# Altium project SmartHome V3.PrjPCB
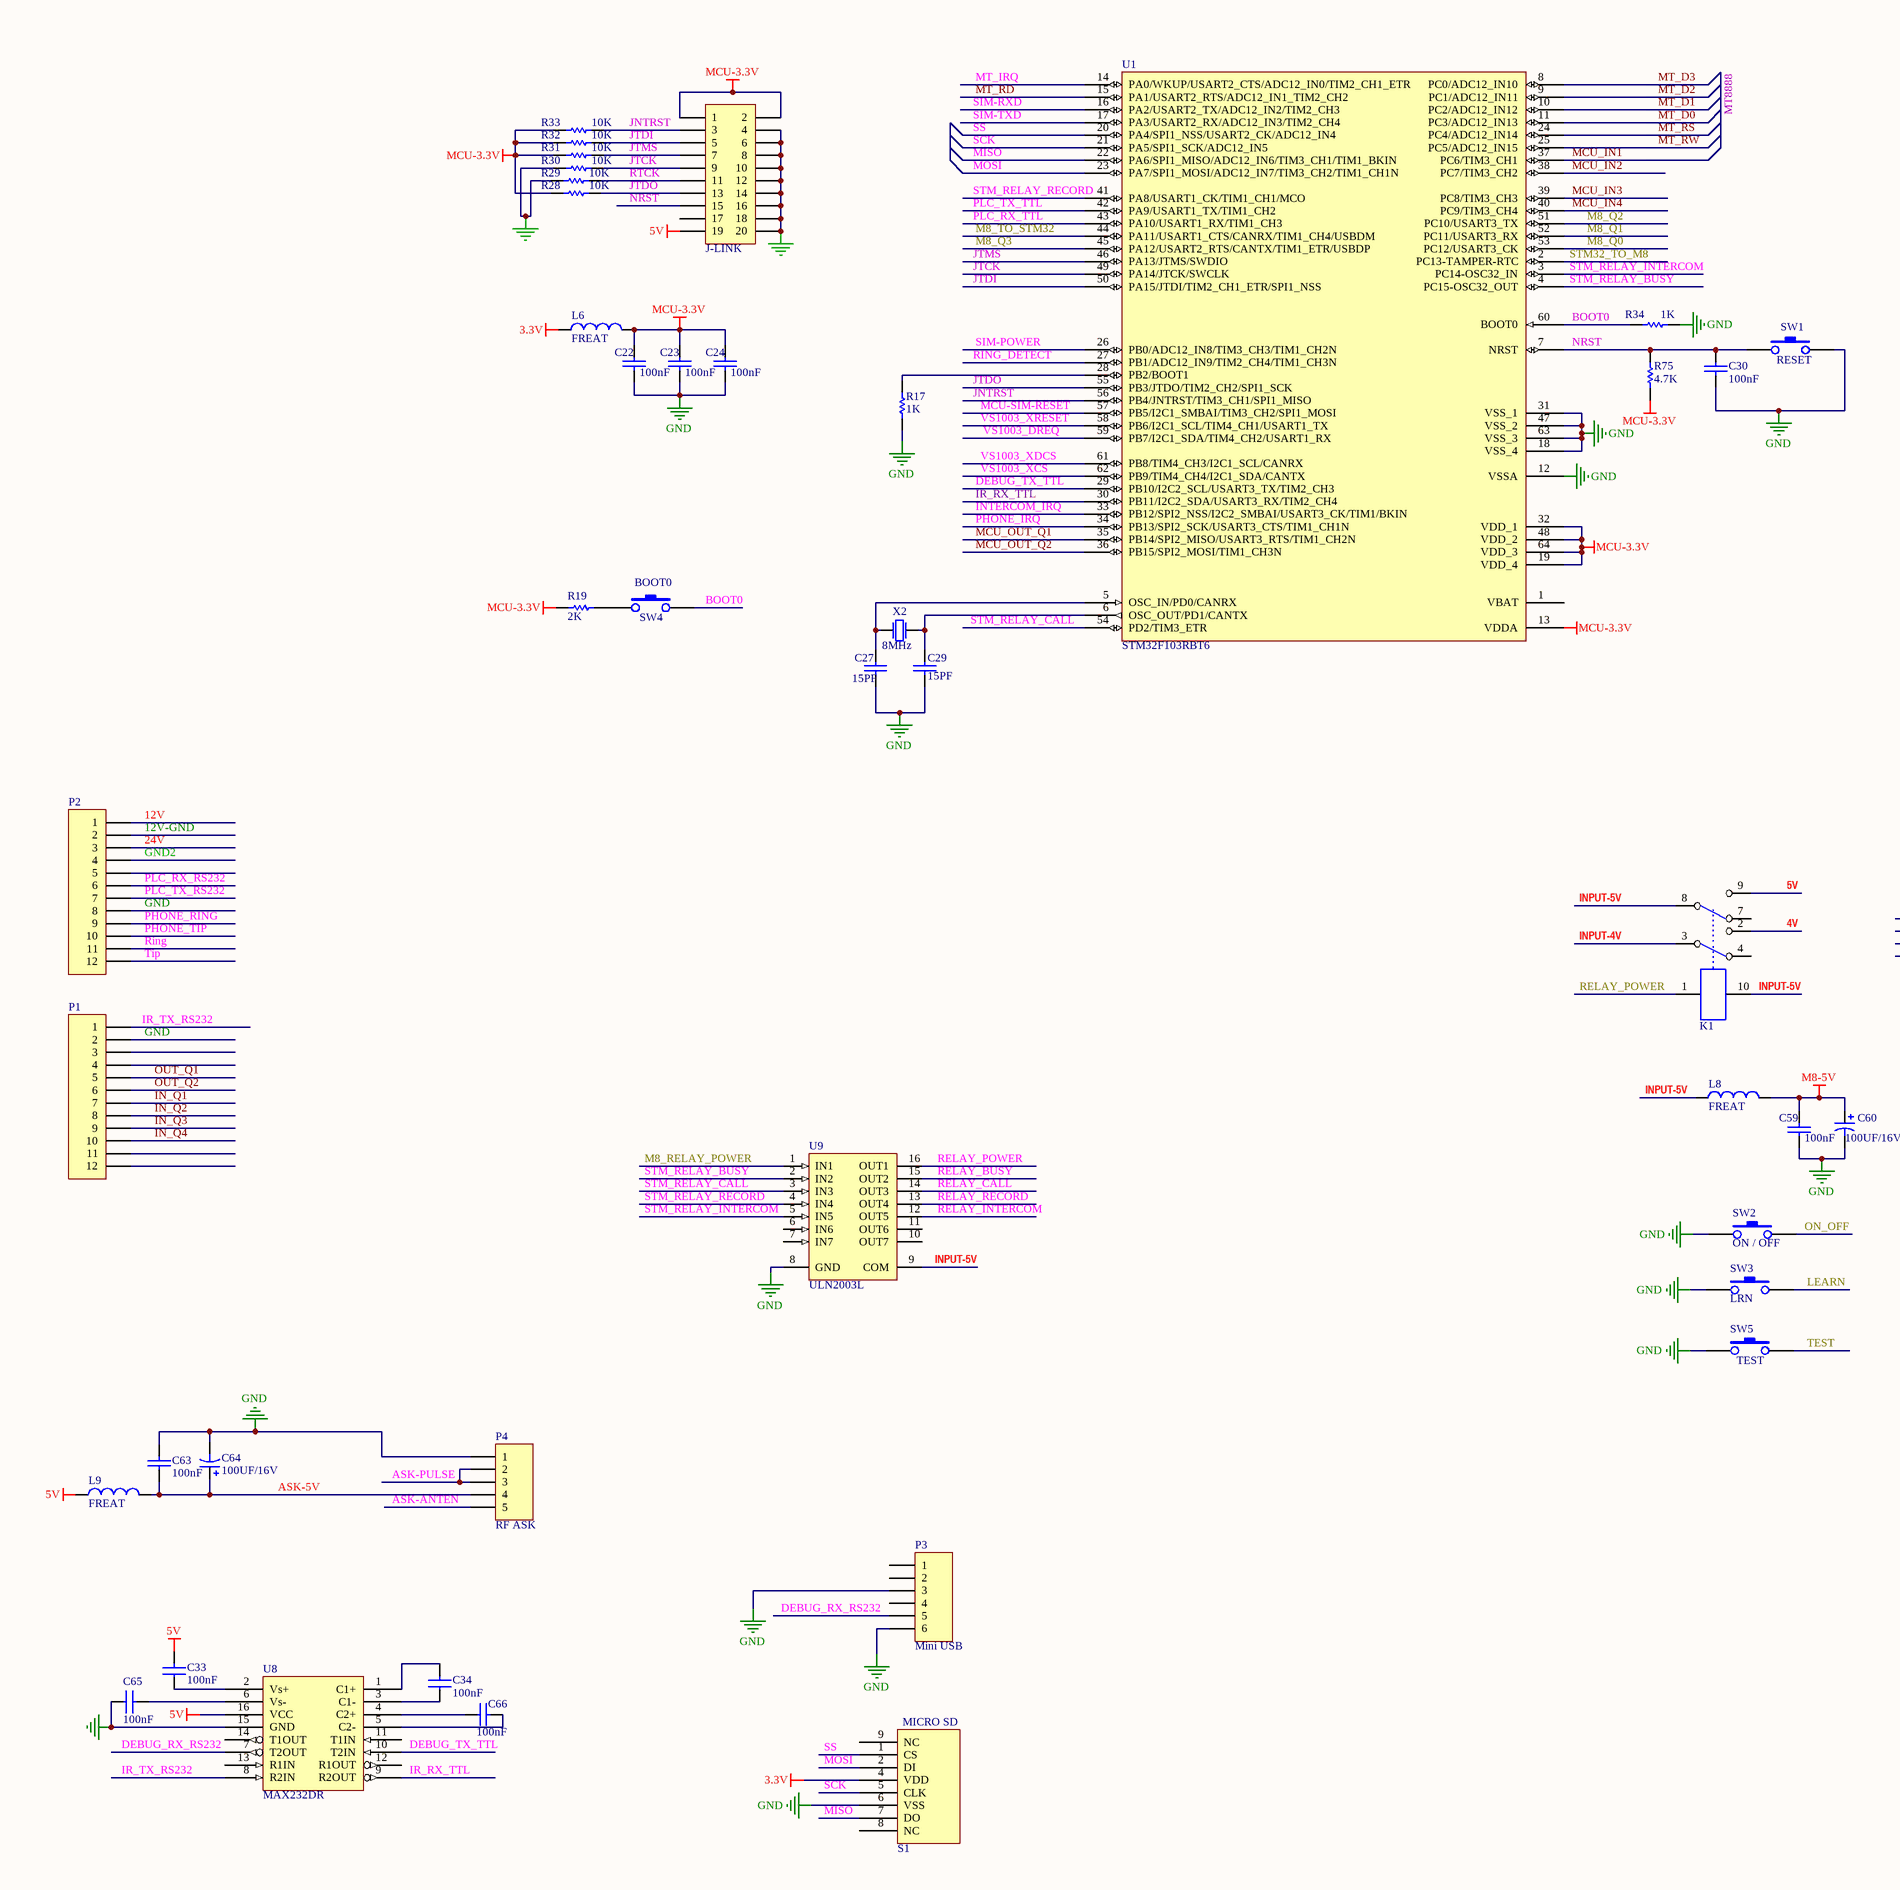
[diagram p0: SmartHome V3.SchDoc, left]
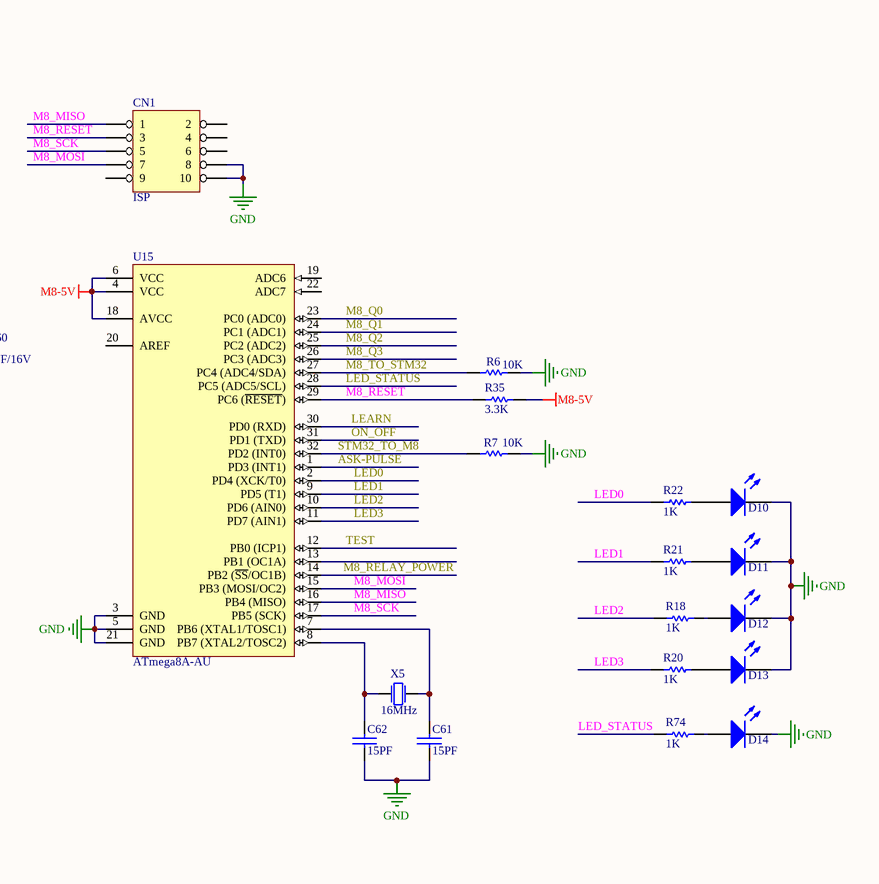
[diagram p1: SmartHome V3.SchDoc, right]
6 sheets, 247 parts. Net scope: global (net labels, ports and power ports of the same name join across sheets).
Board file: SmartHome V3.PcbDoc
Sheets:
  SmartHome V3.SchDoc
  SIM900.SchDoc
  VS1003.SchDoc
  POWER.SchDoc
  PHONE.SchDoc
  PLC.SchDoc

## Sheet SmartHome V3.SchDoc
size A2

### Parts
C22  100nF  [0805C]
C23  100nF  [0805C]
C24  100nF  [0805C]
C27  15PF  [0805c]
C29  15PF  [0805c]
C30  100nF  [0805C]
C33  100nF  [0805C]
C34  100nF  [0805c]
C59  100nF  [0805C]
C60  value 100UF/16V  [100UF-SMD]  (hidden comment: 100uF / 16V SMD)
C61  15PF  [0805c]
C62  15PF  [0805c]
C63  100nF  [0805C]
C64  value 100UF/16V  [100UF-SMD]  (hidden comment: 100uF / 16V SMD)
C65  100nF  [0805c]
C66  100nF  [0805c]
CN1  ISP  [IDC2.54-V10D]
D10  LED  [0805D]  (value not drawn)
D11  LED  [0805D]  (value not drawn)
D12  LED  [0805D]  (value not drawn)
D13  LED  [0805D]  (value not drawn)
D14  LED  [0805D]  (value not drawn)
J-LINK  IDC 20  [IDC2.54-V20D]  (value not drawn)
K1  RELAY 5V  [RELAY G6H]  (value not drawn)
L6  FREAT  [1206]
L8  FREAT  [1206]
L9  FREAT  [1206]
P1  FONIX-12  [Fonit_Conector]  (value not drawn)
P2  FONIX-12  [Fonit_Conector]  (value not drawn)
P3  Mini USB  [miniusb]
P4  RF ASK  [ASK-RF]
R6  10K  [0805]
R7  10K  [0805]
R17  value 1K  [0805]  (hidden comment: 10K)
R18  1K  [0805]
R19  value 2K  [0805]  (hidden comment: 10K)
R20  1K  [0805]
R21  1K  [0805]
R22  1K  [0805]
R28  10K  [0805]
R29  10K  [0805]
R30  10K  [0805]
R31  10K  [0805]
R32  10K  [0805]
R33  10K  [0805]
R34  1K  [0805]
R35  3.3K  [0805]
R74  1K  [0805]
R75  4.7K  [0805]
S1  MICRO SD  [MicroSD]
SW1  SWITCH  [SWICH]  (value not drawn)
SW2  SWITCH  [SWICH]  (value not drawn)
SW3  SWITCH  [SWICH]  (value not drawn)
SW4  SWITCH  [SWICH]  (value not drawn)
SW5  SWITCH  [SWICH]  (value not drawn)
U1  STM32F103RBT6  [LQFP64_L]
U8  MAX232DR  [L16_N]
U9  ULN2003L  [L16_N]
U15  ATmega8A-AU  [32A_N]
X2  8MHz  [crystal]
X5  16MHz  [crystal]

### Nets
3.3V: L6.2 S1.4(VDD)
4V: K1.2(NO1)
5V: C33.2 J-LINK.19 K1.9(NO2) L9.1 U8.16(VCC)
24V: P2.3
GND: C22.2 C23.2 C24.2 C27.2 C29.2 C30.2 C59.2 C60.2 C61.2 C62.2 C63.2 C64.2 C65.1 CN1.8 CN1.10 D10.2(K) D11.2(K) D12.2(K) D13.2(K) D14.2(K) J-LINK.4 J-LINK.6 J-LINK.8 J-LINK.10 J-LINK.12 J-LINK.14 J-LINK.16 J-LINK.18 J-LINK.20 P1.2 P2.8 P3.3 P3.6 P4.1 R6.2 R7.2 R17.1 R29.2 R30.2 R34.2 S1.6(VSS) SW1.2 SW2.2 SW3.2 SW5.2 U1.12(VSSA) U1.18(VSS_4) U1.31(VSS_1) U1.47(VSS_2) U1.63(VSS_3) U8.15(GND) U9.8(GND) U15.3(GND) U15.5(GND) U15.21(GND)
GND2: P2.4
M8-5V: C59.1 C60.1 L8.1 R35.2 U15.4(VCC) U15.6(VCC) U15.18(AVCC)
MCU-3.3V: C22.1 C23.1 C24.1 J-LINK.1 J-LINK.2 L6.1 R19.2 R28.2 R31.2 R32.2 R33.2 R75.2 U1.13(VDDA) U1.19(VDD_4) U1.32(VDD_1) U1.48(VDD_2) U1.64(VDD_3)
12V: P2.1
12V-GND: P2.2
ASK-5V: C63.1 C64.1 L9.2 P4.4
ASK-ANTEN: P4.5
ASK-PULSE: P4.2 P4.3 U15.1(PD3_(INT1))
BOOT0: R34.1 SW4.1 U1.60(BOOT0)
DEBUG_RX_RS232: P3.5 U8.7(T2OUT)
DEBUG_TX_TTL: U1.29(PB10/I2C2_SCL/USART3_TX/TIM2_CH3) U8.10(T2IN)
IN_Q1: P1.7
IN_Q2: P1.8
IN_Q3: P1.9
IN_Q4: P1.10
INPUT-4V: K1.3(C1)
INPUT-5V: K1.8(C2) K1.10(-) L8.2 U9.9(COM)
INTERCOM_IRQ: U1.33(PB12/SPI2_NSS/I2C2_SMBAI/USART3_CK/TIM1/BKIN)
IR_RX_TTL: U1.30(PB11/I2C2_SDA/USART3_RX/TIM2_CH4) U8.9(R2OUT)
IR_TX_RS232: P1.1 U8.8(R2IN)
JNTRST: J-LINK.3 R33.1 U1.56(PB4/JNTRST/TIM3_CH1/SPI1_MISO)
JTCK: J-LINK.9 R30.1 U1.49(PA14/JTCK/SWCLK)
JTDI: J-LINK.5 R32.1 U1.50(PA15/JTDI/TIM2_CH1_ETR/SPI1_NSS)
JTDO: J-LINK.13 R28.1 U1.55(PB3/JTDO/TIM2_CH2/SPI1_SCK)
JTMS: J-LINK.7 R31.1 U1.46(PA13/JTMS/SWDIO)
LEARN: SW3.1 U15.30(PD0_(RXD))
LED0: R22.1 U15.2(PD4_(XCK/T0))
LED1: R21.1 U15.9(PD5_(T1))
LED2: R18.1 U15.10(PD6_(AIN0))
LED3: R20.1 U15.11(PD7_(AIN1))
LED_STATUS: R74.1 U15.28(PC5_(ADC5/SCL))
M8_MISO: CN1.1 U15.16(PB4_(MISO))
M8_MOSI: CN1.7 U15.15(PB3_(MOSI/OC2))
M8_Q0: U1.53(PC12/USART3_CK) U15.23(PC0_(ADC0))
M8_Q1: U1.52(PC11/USART3_RX) U15.24(PC1_(ADC1))
M8_Q2: U1.51(PC10/USART3_TX) U15.25(PC2_(ADC2))
M8_Q3: U1.45(PA12/USART2_RTS/CANTX/TIM1_ETR/USBDP) U15.26(PC3_(ADC3))
M8_RELAY_POWER: U9.1(IN1) U15.14(PB2_(~{SS}/OC1B))
M8_RESET: CN1.3 R35.1 U15.29(PC6_(~{RESET}))
M8_SCK: CN1.5 U15.17(PB5_(SCK))
M8_TO_STM32: R6.1 U1.44(PA11/USART1_CTS/CANRX/TIM1_CH4/USBDM) U15.27(PC4_(ADC4/SDA))
MCU-SIM-RESET: U1.57(PB5/I2C1_SMBAI/TIM3_CH2/SPI1_MOSI)
MCU_IN1: U1.37(PC6/TIM3_CH1)
MCU_IN2: U1.38(PC7/TIM3_CH2)
MCU_IN3: U1.39(PC8/TIM3_CH3)
MCU_IN4: U1.40(PC9/TIM3_CH4)
MCU_OUT_Q1: U1.35(PB14/SPI2_MISO/USART3_RTS/TIM1_CH2N)
MCU_OUT_Q2: U1.36(PB15/SPI2_MOSI/TIM1_CH3N)
MISO: S1.7(DO) U1.22(PA6/SPI1_MISO/ADC12_IN6/TIM3_CH1/TIM1_BKIN)
MOSI: S1.2(DI) U1.23(PA7/SPI1_MOSI/ADC12_IN7/TIM3_CH2/TIM1_CH1N)
MT_D0: U1.11(PC3/ADC12_IN13)
MT_D1: U1.10(PC2/ADC12_IN12)
MT_D2: U1.9(PC1/ADC12_IN11)
MT_D3: U1.8(PC0/ADC12_IN10)
MT_IRQ: U1.14(PA0/WKUP/USART2_CTS/ADC12_IN0/TIM2_CH1_ETR)
MT_RD: U1.15(PA1/USART2_RTS/ADC12_IN1_TIM2_CH2)
MT_RS: U1.24(PC4/ADC12_IN14)
MT_RW: U1.25(PC5/ADC12_IN15)
NRST: C30.1 J-LINK.15 R75.1 SW1.1 U1.7(NRST)
ON_OFF: SW2.1 U15.31(PD1_(TXD))
OUT_Q1: P1.5
OUT_Q2: P1.6
PHONE_IRQ: U1.34(PB13/SPI2_SCK/USART3_CTS/TIM1_CH1N)
PHONE_RING: P2.9
PHONE_TIP: P2.10
PLC_RX_RS232: P2.6
PLC_RX_TTL: U1.43(PA10/USART1_RX/TIM1_CH3)
PLC_TX_RS232: P2.7
PLC_TX_TTL: U1.42(PA9/USART1_TX/TIM1_CH2)
RELAY_BUSY: U9.15(OUT2)
RELAY_CALL: U9.14(OUT3)
RELAY_INTERCOM: U9.12(OUT5)
RELAY_POWER: K1.1(+) U9.16(OUT1)
RELAY_RECORD: U9.13(OUT4)
Ring: P2.11
RING_DETECT: U1.27(PB1/ADC12_IN9/TIM2_CH4/TIM1_CH3N)
RTCK: J-LINK.11 R29.1
SCK: S1.5(CLK) U1.21(PA5/SPI1_SCK/ADC12_IN5)
SIM-POWER: U1.26(PB0/ADC12_IN8/TIM3_CH3/TIM1_CH2N)
SIM-RXD: U1.16(PA2/USART2_TX/ADC12_IN2/TIM2_CH3)
SIM-TXD: U1.17(PA3/USART2_RX/ADC12_IN3/TIM2_CH4)
SS: S1.1(CS) U1.20(PA4/SPI1_NSS/USART2_CK/ADC12_IN4)
STM32_TO_M8: R7.1 U1.2(PC13-TAMPER-RTC) U15.32(PD2_(INT0))
STM_RELAY_BUSY: U1.4(PC15-OSC32_OUT) U9.2(IN2)
STM_RELAY_CALL: U1.54(PD2/TIM3_ETR) U9.3(IN3)
STM_RELAY_INTERCOM: U1.3(PC14-OSC32_IN) U9.5(IN5)
STM_RELAY_RECORD: U1.41(PA8/USART1_CK/TIM1_CH1/MCO) U9.4(IN4)
TEST: SW5.1 U15.12(PB0_(ICP1))
Tip: P2.12
VS1003_DREQ: U1.59(PB7/I2C1_SDA/TIM4_CH2/USART1_RX)
VS1003_XCS: U1.62(PB9/TIM4_CH4/I2C1_SDA/CANTX)
VS1003_XDCS: U1.61(PB8/TIM4_CH3/I2C1_SCL/CANRX)
VS1003_XRESET: U1.58(PB6/I2C1_SCL/TIM4_CH1/USART1_TX)
NetC27_1: C27.1 U1.5(OSC_IN/PD0/CANRX) X2.2(P2)
NetC29_1: C29.1 U1.6(OSC_OUT/PD1/CANTX) X2.1(P1)
NetC33_1: C33.1 U8.2(Vs+)
NetC34_1: C34.1 U8.3(C1-)
NetC34_2: C34.2 U8.1(C1+)
NetC61_1: C61.1 U15.7(PB6_(XTAL1/TOSC1)) X5.1(P1)
NetC62_1: C62.1 U15.8(PB7_(XTAL2/TOSC2)) X5.2(P2)
NetC65_2: C65.2 U8.6(Vs-)
NetC66_1: C66.1 U8.4(C2+)
NetC66_2: C66.2 U8.5(C2-)
NetD10_1: D10.1(A) R22.2
NetD11_1: D11.1(A) R21.2
NetD12_1: D12.1(A) R18.2
NetD13_1: D13.1(A) R20.2
NetD14_1: D14.1(A) R74.2
NetR17_2: R17.2 U1.28(PB2/BOOT1)
NetR19_1: R19.1 SW4.2

Not connected (* = marked no-connect by the designer): CN1 2 4 6 9; J-LINK 17; K1 4(NC1) 7(NC2); P1 3 4 11 12; P2 5; P3 1 2 4; S1 8(NC) 9(NC); U1 1(VBAT); U8 11(T1IN) 12(R1OUT) 13(R1IN) 14(T1OUT); U9 6(IN6) 7(IN7) 10(OUT7) 11(OUT6); U15 13(PB1_(OC1A)) 19(ADC6) 20(AREF) 22(ADC7)

### Buses and harness runs
bus MT8888

### Notes on the sheet
- (in symbol SW-PB) RESET; BOOT0; LRN; ON / OFF; TEST

### Library data of the parts
C22-C24 C59 C63 = CAP
C27 C29 C61 C62 = CAP: Capacitor; Section Code: 12103412
C30 = CAP: Capacitor; Section Code: 12123895
C33 C34 C65 C66 = CAP NP: Part Field 1: CS; Section Code: 12103465; Part Field 2: 0603; Part Field 3: 20V
C60 C64 = Cap Pol1: Polarized Capacitor (Radial)
CN1 = HEADER 5X2: Section Code: 30101139
D10-D14 = LED3: Typical BLUE SiC LED; Published: 8-Jun-2000; LatestRevisionDate: 17-Dec-2003; LatestRevisionNote: PCB Footprint replaced.; DatasheetVersion: 16-Apr-2002; PackageVersion: 16-Apr-2002; PackageReference: 3.5X2.8X1.9; Publisher: Altium Limited; PackageDescription: SM LED; 2 C-Bend Leads; Body 3.5 x 2.8 x 1.9 mm, inc leads (LxWxH typ)
J-LINK = Header 10X2: Header, 10-Pin, Dual row; E: 30101131; LatestRevisionDate: 17-Jul-2002; LatestRevisionNote: Re-released for DXP Platform.; Publisher: Altium Limited; Published: 12103757
K1 = RELAY DPDT-G6HU
L6 L8 L9 = Inductor: Code_IEC: 1005; Value: 250mA; Published: 8-Jun-2000; LatestRevisionDate: 29-May-2009; LatestRevisionNote: IPC-7351 Footprint Added.; PackageReference: 0402-A; Publisher: Altium Limited; PackageDescription: Chip Inductor; Code_JEITA: 0402
P1 P2 = Header 12: Header, 12-Pin; LatestRevisionDate: 17-Jul-2002; LatestRevisionNote: Re-released for DXP Platform.; Publisher: Altium Limited
P3 P4 = Header 5: Header, 5-Pin; LatestRevisionDate: 17-Jul-2002; LatestRevisionNote: Re-released for DXP Platform.
  P3: Publisher: DEBUGGER
  P4: Publisher: Altium Limited
R6 R7 R17 R19 R34 R35 R75 = Res Semi: Semiconductor Resistor; Published: 8-Jun-2000; LatestRevisionDate: 17-Jul-2002; LatestRevisionNote: Re-released for DXP Platform.; PackageReference: AXIAL-0.5; Publisher: Altium Limited; PackageDescription: Axial Device, Thru-Hole; 2 Leads; 0.5 in Pin Spacing
  R6 R7: Value: 10K
  R34: Value: 1K
  R35: Value: 3.3K
  R75: Value: 4.7K
R18 R20-R22 R74 = Res1: Resistor; Published: 8-Jun-2000; Revision: July-2002: Re-released for DXP Platform.; Publisher: Altium Limited; Value: 1K
R28-R33 = Res1: Resistor; E: 11113371; Published: 12103465; LatestRevisionDate: 17-Jul-2002; LatestRevisionNote: Re-released for DXP Platform.; PackageReference: AXIAL-0.3; Publisher: Altium Limited; Value: 10K
S1 = Component_1_1
SW1-SW5 = SW-PB: Section Code: 20106004
U1 = STM32F103RBT6: STM32 ARM-based 32-bit MCU with 128 Kbytes Flash, 64-pin LQFP, Industrial Temperature; Published: 30-May-2008; DatasheetVersion: rev6, Mar-2008; PackageVersion: Mar-2008; PackageReference: LQFP64; Publisher: Altium Limited; PackageDescription: 64-Pin Low-Profile Quad Flat Pack, 10 x 10 mm Body, 0.5 mm Pitch (LQFP64); ComponentLink1Description: Manufacturer Link; ComponentLink1URL: www.st.com/stm32; ComponentLink2Description: Datasheet; ComponentLink2URL: http://www.st.com/stonline/products/literature/ds/13587.pdf
U8 = MAX232: DUAL EIA-232 DRIVER/RECEIVER; Part Field 1: US; Section Code: 14203714; Part Field 2: SOL-16
U9 = ULN2003L: High-Voltage, High-Current Darlington Array; Published: 13-Oct-2000; LatestRevisionDate: 13-Apr-2006; LatestRevisionNote: IPC-7351 Footprint Added.; DatasheetVersion: 1998; PackageReference: L16; Publisher: Altium Limited; PackageDescription: 16-Pin Small Outline Integrated Circuit 1.27 mm Pitch; Code_JEDEC: MS-012-AC; Code_IPC: SOIC127P600-16; ComponentLink1Description: Manufacturer Link; ComponentLink1URL: http://www.allegromicro.com/
U15 = ATmega8A-AU: 8-bit AVR Microcontroller, 8KB Flash, 512 Bytes EEPROM, 1KB SRAM, 32-pin TQFP, Industrial Grade (-40°C to 85°C); Published: 1-Apr-2010; DatasheetVersion: revC, Jul-2009; PackageVersion: revB, Oct-2001; PackageReference: 32A; Publisher: Altium Limited; PackageDescription: 32-Lead, 7x7x1.0 mm Body, 0.8mm Lead Pitch, Thin Profile Plastic Quad Flat Package (TQFP); Supplier 1: Digi-Key; Supplier Part Number 1: ATMEGA8A-AU-ND; Supplier 2: Farnell; Supplier Part Number 2: 1748532; Supplier 3: Mouser; Supplier Part Number 3: 556-ATMEGA8A-AU; Code_JEDEC: MS-026-ABA; ComponentLink1Description: Manufacturer Link; ComponentLink1URL: http://www.atmel.com/products/avr/default.asp?; ComponentLink2Description: ATmega8A Datasheet; ComponentLink2URL: http://www.atmel.com/dyn/resources/prod_documents/doc8159.pdf; ComponentLink3Description: ATmega8A Summary; ComponentLink3URL: http://www.atmel.com/dyn/resources/prod_documents/8159S.pdf; ComponentLink4Description: Atmel.com Home; ComponentLink4URL: http://www.atmel.com
X2 X5 = 16.000MHZ: Crystal Oscillator; Section Code: 18201307; Part Field 2: HC49; Part Field 4: 1ppm

## Sheet SIM900.SchDoc
size A3
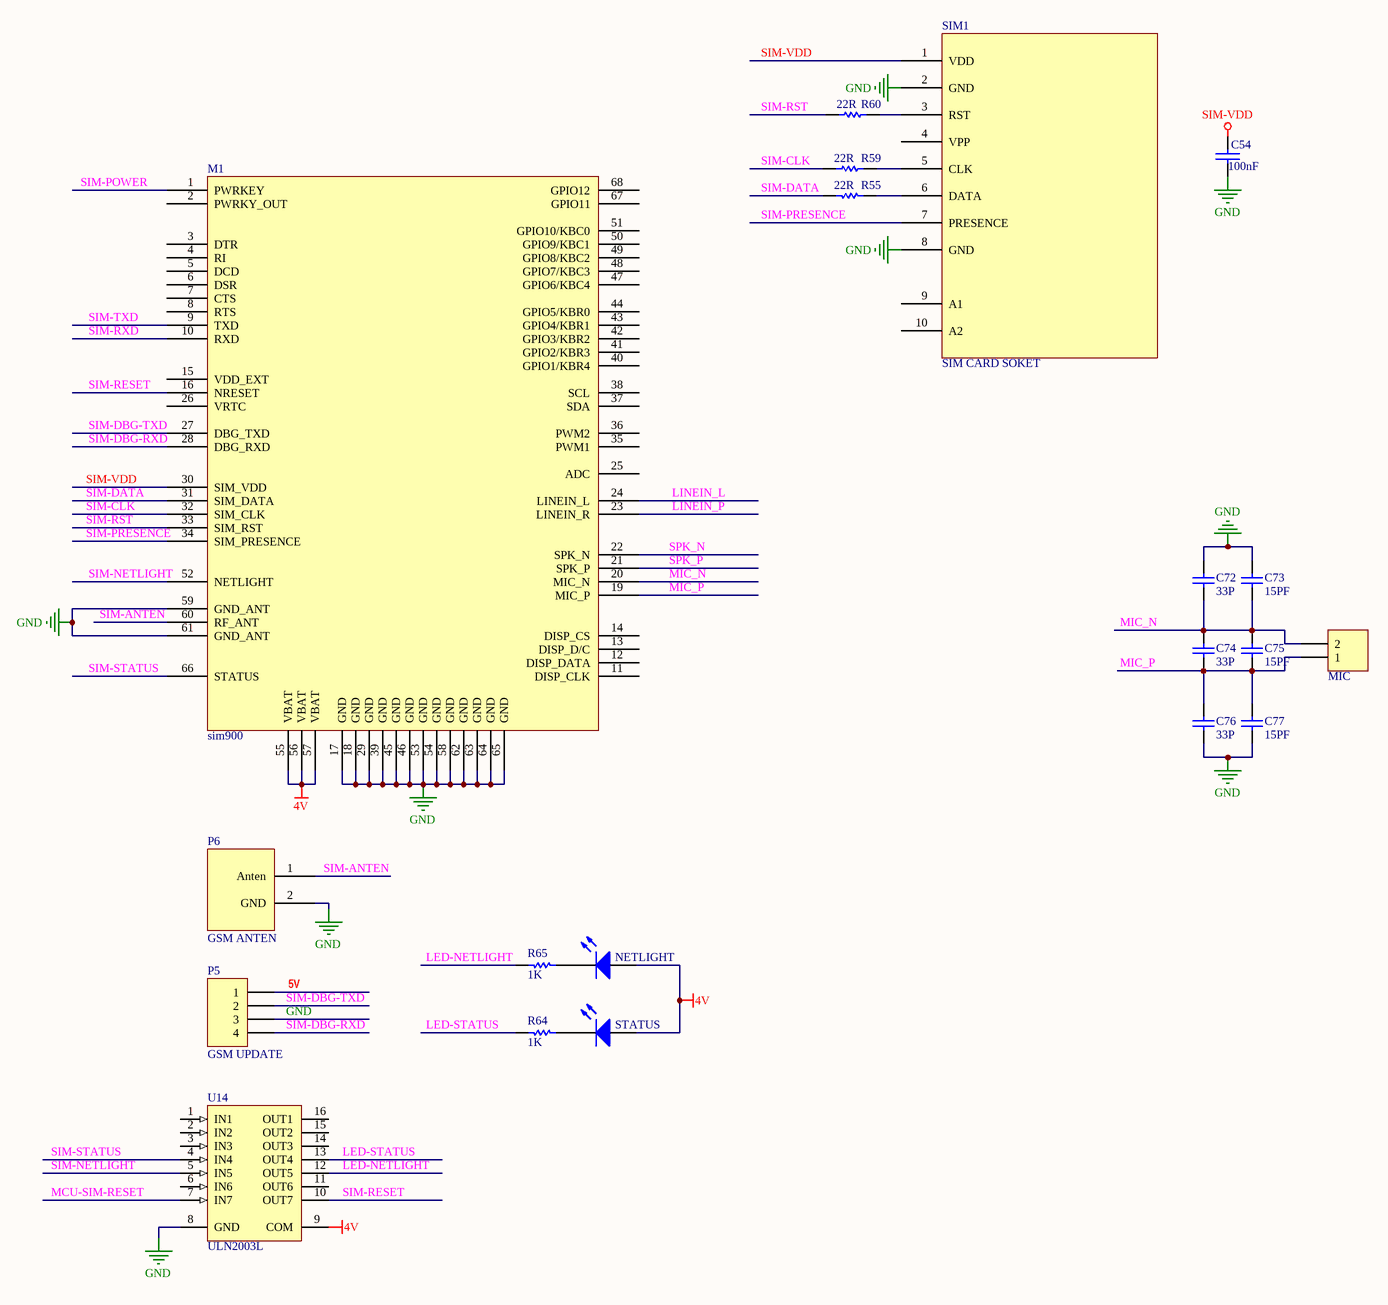
[diagram p2: SIM900.SchDoc]

### Parts
(Parts that share a designator on the sheet are numbered #1, #2 ... from top to bottom, then left to right.)
C54  100nF  [0805C]
C72  33P  [0805C]
C73  15PF  [0805C]
C74  33P  [0805C]
C75  15PF  [0805C]
C76  33P  [0805C]
C77  15PF  [0805C]
M1  sim900  [sim900]
MIC#1  CON 2PIN  [Microphone]  (value not drawn)
NETLIGHT  LED  [0805D]  (value not drawn)
P5  Publisher: GSM UPDATE  [CON_4PIN]  (hidden comment: CON 4)
P6  GSM ANTEN  [anten-jack]
R55  22R  [0805]
R59  22R  [0805]
R60  22R  [0805]
R64  1K  [0805]
R65  1K  [0805]
SIM1  SIM CARD SOKET  [SIM HOLDER 2]
STATUS  LED  [0805D]  (value not drawn)
U14  ULN2003L  [L16_N]

### Nets
4V: M1.55(VBAT) M1.56(VBAT) M1.57(VBAT) NETLIGHT.1(A) STATUS.1(A) U14.9(COM)
5V: P5.1
GND: C54.2 C72.1 C73.1 C76.2 C77.2 M1.17(GND) M1.18(GND) M1.29(GND) M1.39(GND) M1.45(GND) M1.46(GND) M1.53(GND) M1.54(GND) M1.58(GND) M1.59(GND_ANT) M1.61(GND_ANT) M1.62(GND) M1.63(GND) M1.64(GND) M1.65(GND) P5.3 P6.2(GND) SIM1.2(GND) SIM1.8(GND) U14.8(GND)
SIM-VDD: C54.1 M1.30(SIM_VDD) SIM1.1(VDD)
LED-NETLIGHT: R65.2 U14.12(OUT5)
LED-STATUS: R64.2 U14.13(OUT4)
LINEIN_L: M1.24(LINEIN_L)
LINEIN_P: M1.23(LINEIN_R)
MCU-SIM-RESET: U14.7(IN7)
MIC_N: C72.2 C73.2 C74.1 C75.1 M1.20(MIC_N) MIC#1.2
MIC_P: C74.2 C75.2 C76.1 C77.1 M1.19(MIC_P) MIC#1.1
SIM-ANTEN: M1.60(RF_ANT) P6.1(Anten)
SIM-CLK: M1.32(SIM_CLK) R59.1
SIM-DATA: M1.31(SIM_DATA) R55.2
SIM-DBG-RXD: M1.28(DBG_RXD) P5.4
SIM-DBG-TXD: M1.27(DBG_TXD) P5.2
SIM-NETLIGHT: M1.52(NETLIGHT) U14.5(IN5)
SIM-POWER: M1.1(PWRKEY)
SIM-PRESENCE: M1.34(SIM_PRESENCE) SIM1.7(PRESENCE)
SIM-RESET: M1.16(NRESET) U14.10(OUT7)
SIM-RST: M1.33(SIM_RST) R60.1
SIM-RXD: M1.10(RXD)
SIM-STATUS: M1.66(STATUS) U14.4(IN4)
SIM-TXD: M1.9(TXD)
SPK_N: M1.22(SPK_N)
SPK_P: M1.21(SPK_P)
NetNETLIGHT_2: NETLIGHT.2(K) R65.1
NetR55_1: R55.1 SIM1.6(DATA)
NetR59_2: R59.2 SIM1.5(CLK)
NetR60_2: R60.2 SIM1.3(RST)
NetR64_1: R64.1 STATUS.2(K)

Not connected (* = marked no-connect by the designer): M1 2(PWRKY_OUT) 3(DTR) 4(RI) 5(DCD) 6(DSR) 7(CTS) 8(RTS) 11(DISP_CLK) 12(DISP_DATA) 13(DISP_D/C) 14(DISP_CS) 15(VDD_EXT) 25(ADC) 26(VRTC) 35(PWM1) 36(PWM2) 37(SDA) 38(SCL) 40(GPIO1/KBR4) 41(GPIO2/KBR3) 42(GPIO3/KBR2) 43(GPIO4/KBR1) 44(GPIO5/KBR0) 47(GPIO6/KBC4) 48(GPIO7/KBC3) 49(GPIO8/KBC2) 50(GPIO9/KBC1) 51(GPIO10/KBC0) 67(GPIO11) 68(GPIO12); SIM1 4(VPP) 9(A1) 10(A2); U14 1(IN1) 2(IN2) 3(IN3) 6(IN6) 11(OUT6) 14(OUT3) 15(OUT2) 16(OUT1)

### Library data of the parts
C54 = CAP
C72 C74 = Cap: Capacitor; Value: 33pF; Published: 8-Jun-2000; Revision: July-2002: Re-released for DXP Platform.; Publisher: Altium Limited
C73 C75 C77 = Cap: Capacitor; Published: 8-Jun-2000; Revision: July-2002: Re-released for DXP Platform.; Publisher: Altium Limited
C76 = Cap: Capacitor; Value: 100pF; Published: 8-Jun-2000; Revision: July-2002: Re-released for DXP Platform.; Publisher: Altium Limited
MIC#1 = Header 2H: Header, 2-Pin, Right Angle; LatestRevisionDate: 17-Jul-2002; LatestRevisionNote: Re-released for DXP Platform.; Publisher: Altium Limited
NETLIGHT STATUS = LED0: Typical INFRARED GaAs LED; Published: 8-Jun-2000; LatestRevisionDate: 08-Jul-2005; LatestRevisionNote: Mech Layer 1 removed.; PackageReference: LED-0; Publisher: Altium Limited
P5 = Header 4H: Header, 4-Pin, Right Angle; LatestRevisionDate: 17-Jul-2002; LatestRevisionNote: Re-released for DXP Platform.
P6 = Anten
R55 R59 R60 = Res1: Resistor; Value: 1K; Published: 8-Jun-2000; Revision: July-2002: Re-released for DXP Platform.; Publisher: Altium Limited
R64 R65 = Res1: Resistor; Published: 8-Jun-2000; LatestRevisionDate: 17-Jul-2002; LatestRevisionNote: Re-released for DXP Platform.; PackageReference: AXIAL-0.3; Publisher: Altium Limited; Value: 1K
SIM1 = SIM HOLDER
U14 = ULN2003L: as U9 on sheet SmartHome V3; Published: 13-Oct-2000; LatestRevisionDate: 13-Apr-2006; LatestRevisionNote: IPC-7351 Footprint Added.; DatasheetVersion: 1998; PackageReference: L16; Publisher: Altium Limited; PackageDescription: 16-Pin Small Outline Integrated Circuit 1.27 mm Pitch; Code_JEDEC: MS-012-AC; Code_IPC: SOIC127P600-16; ComponentLink1Description: Manufacturer Link; ComponentLink1URL: http://www.allegromicro.com/

## Sheet VS1003.SchDoc
size A3
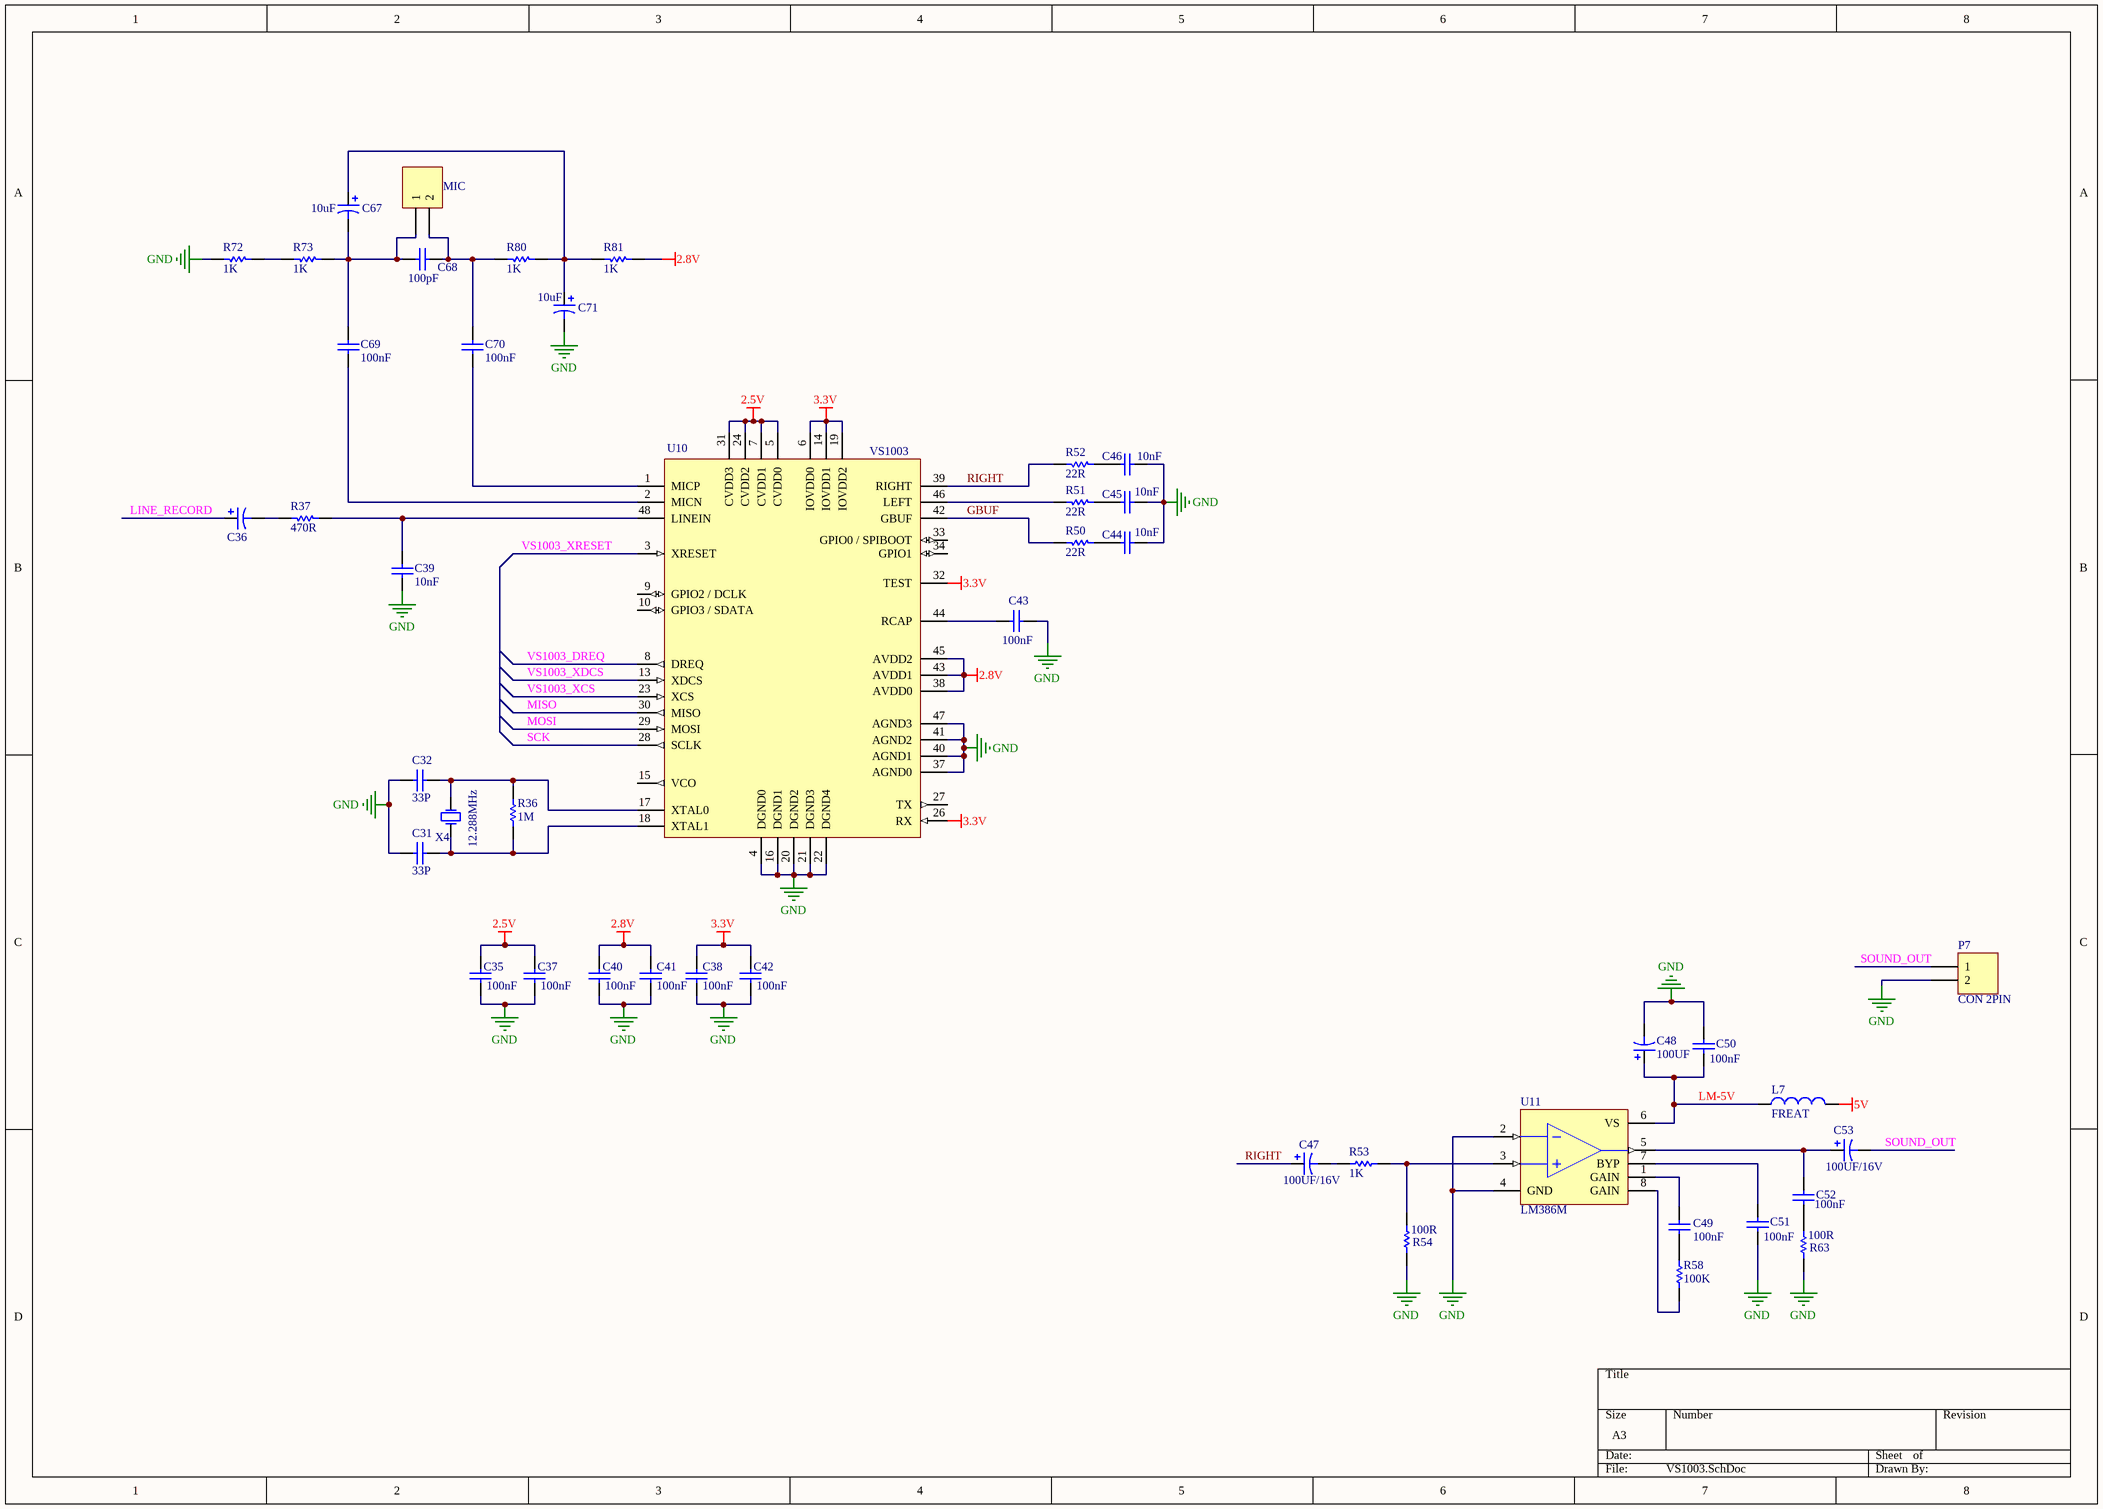
[diagram p3: VS1003.SchDoc]

### Parts
(Parts that share a designator on the sheet are numbered #1, #2 ... from top to bottom, then left to right.)
C31  33P  [0805c]
C32  33P  [0805c]
C35  100nF  [0805C]
C36  100uF / 16V SMD  [100UF-SMD]  (value not drawn)
C37  100nF  [0805C]
C38  100nF  [0805C]
C39  10nF  [0805C]
C40  100nF  [0805C]
C41  100nF  [0805C]
C42  100nF  [0805C]
C43  100nF  [0805C]
C44  10nF  [0805C]
C45  10nF  [0805C]
C46  10nF  [0805C]
C47  value 100UF/16V  [100UF-SMD]  (hidden comment: 100uF / 16V SMD)
C48  value 100UF  [100uf-smd]  (hidden comment: 100uF / 16V SMD)
C49  100nF  [0805c]
C50  100nF  [0805c]
C51  100nF  [0805c]
C52  100nF  [0805c]
C53  value 100UF/16V  [100UF-SMD]  (hidden comment: 100uF / 16V SMD)
C67  10uF  [10UF-SMD]
C68  100pF  [0805C]
C69  100nF  [0805C]
C70  100nF  [0805C]
C71  10uF  [10UF-SMD]
L7  FREAT  [1206]
MIC#2  CON 2PIN  [Microphone]  (value not drawn)
P7  CON 2PIN  [CON_2PIN]
R36  1M  [0805]
R37  470R  [0805]
R50  22R  [0805]
R51  22R  [0805]
R52  22R  [0805]
R53  1K  [0805]
R54  100R  [0805]
R58  100K  [0805]
R63  100R  [0805]
R72  1K  [0805]
R73  1K  [0805]
R80  1K  [0805]
R81  1K  [0805]
U10  VS1003  [48A]
U11  LM386M  [M08A_N]
X4  12.288MHz  [crystal]

### Nets
2.5V: C35.2 C37.2 U10.5(CVDD0) U10.7(CVDD1) U10.24(CVDD2) U10.31(CVDD3)
2.8V: C40.2 C41.2 R81.1 U10.38(AVDD0) U10.43(AVDD1) U10.45(AVDD2)
3.3V: C38.2 C42.2 U10.6(IOVDD0) U10.14(IOVDD1) U10.19(IOVDD2) U10.26(RX) U10.32(TEST)
5V: L7.2
GND: C31.2 C32.2 C35.1 C37.1 C38.1 C39.2 C40.1 C41.1 C42.1 C43.1 C44.2 C45.2 C46.2 C48.2 C50.2 C51.1 C71.2 P7.2 R54.2 R63.2 R72.2 U10.4(DGND0) U10.16(DGND1) U10.20(DGND2) U10.21(DGND3) U10.22(DGND4) U10.37(AGND0) U10.40(AGND1) U10.41(AGND2) U10.47(AGND3) U11.2(IN-) U11.4(GND)
GBUF: R50.2 U10.42(GBUF)
LINE_RECORD: C36.1
LM-5V: C48.1 C50.1 L7.1 U11.6(VS)
MISO: U10.30(MISO)
MOSI: U10.29(MOSI)
RIGHT: C47.1 R52.2 U10.39(RIGHT)
SCK: U10.28(SCLK)
SOUND_OUT: C53.2 P7.1
VS1003_DREQ: U10.8(DREQ)
VS1003_XCS: U10.23(XCS)
VS1003_XDCS: U10.13(XDCS)
VS1003_XRESET: U10.3(XRESET)
NetC31_1: C31.1 R36.2 U10.18(XTAL1) X4.2(OSC2)
NetC32_1: C32.1 R36.1 U10.17(XTAL0) X4.1(OSC1)
NetC36_2: C36.2 R37.2
NetC39_1: C39.1 R37.1 U10.48(LINEIN)
NetC43_2: C43.2 U10.44(RCAP)
NetC44_1: C44.1 R50.1
NetC45_1: C45.1 R51.1
NetC46_1: C46.1 R52.1
NetC47_2: C47.2 R53.1
NetC49_1: C49.1 R58.1
NetC49_2: C49.2 U11.1(GAIN)
NetC51_2: C51.2 U11.7(BYP)
NetC52_1: C52.1 R63.1
NetC52_2: C52.2 C53.1 U11.5(OUT)
NetC67_1: C67.1 C71.1 R80.1 R81.2
NetC67_2: C67.2 C68.2 C69.1 MIC#2.1 R73.1
NetC68_1: C68.1 C70.1 MIC#2.2 R80.2
NetC69_2: C69.2 U10.2(MICN)
NetC70_2: C70.2 U10.1(MICP)
NetR51_2: R51.2 U10.46(LEFT)
NetR53_2: R53.2 R54.1 U11.3(IN+)
NetR58_2: R58.2 U11.8(GAIN)
NetR72_1: R72.1 R73.2

Not connected (* = marked no-connect by the designer): U10 9(GPIO2_/_DCLK) 10(GPIO3_/_SDATA) 15(VCO) 27(TX) 33(GPIO0_/_SPIBOOT) 34(GPIO1)

### Library data of the parts
C31 C32 = Cap: Capacitor; Value: 33pF; Published: 8-Jun-2000; Revision: July-2002: Re-released for DXP Platform.; Publisher: Altium Limited
C35 C37-C46 C69 C70 = Cap: Capacitor; Value: 100pF; Published: 8-Jun-2000; Revision: July-2002: Re-released for DXP Platform.; Publisher: Altium Limited
C36 C47 C48 C53 C67 C71 = Cap Pol1: Polarized Capacitor (Radial)
  C36 C48 C53 C67 C71: Published: 8-Jun-2000; LatestRevisionDate: 17-Jul-2002; LatestRevisionNote: Re-released for DXP Platform.; PackageReference: RB7.6-15; Publisher: Altium Limited
C49-C52 C68 = Cap: Capacitor; Published: 8-Jun-2000; Publisher: Altium Limited
  C49-C52: LatestRevisionDate: 17-Jul-2002; LatestRevisionNote: Re-released for DXP Platform.; PackageReference: RAD-0.3
  C68: Revision: July-2002: Re-released for DXP Platform.; Value: 100pF
L7 = Inductor: Code_IEC: 1005; Value: 250mA; Published: 8-Jun-2000; LatestRevisionDate: 29-May-2009; LatestRevisionNote: IPC-7351 Footprint Added.; PackageReference: 0402-A; Publisher: Altium Limited; PackageDescription: Chip Inductor; Code_JEITA: 0402
MIC#2 P7 = Header 2H: Header, 2-Pin, Right Angle; LatestRevisionDate: 17-Jul-2002; LatestRevisionNote: Re-released for DXP Platform.; Publisher: Altium Limited
R36 R50-R52 = Res1: Resistor; Value: 1K; Published: 8-Jun-2000; Revision: July-2002: Re-released for DXP Platform.; Publisher: Altium Limited
R37 = Res1: Resistor; Published: 8-Jun-2000; Revision: July-2002: Re-released for DXP Platform.; Publisher: Altium Limited; Value: 470R
R53 R54 R58 R63 = Res Semi: Semiconductor Resistor; Published: 8-Jun-2000; LatestRevisionDate: 17-Jul-2002; LatestRevisionNote: Re-released for DXP Platform.; PackageReference: AXIAL-0.5; Publisher: Altium Limited
  R53: Value: 1K
  R58: Value: 100K
R72 R73 R80 R81 = Res1: Resistor; Value: 470R; Published: 8-Jun-2000; Revision: July-2002: Re-released for DXP Platform.; Publisher: Altium Limited
U11 = LM386M-1: Low-Voltage Audio Power Amplifier; Published: 15-Apr-2002; LatestRevisionDate: 13-Apr-2006; LatestRevisionNote: IPC-7351 Footprint Added.; DatasheetVersion: Sep-1997; PackageVersion: Sep-1997; PackageReference: M08A; Publisher: Altium Limited; PackageDescription: 8-Pin Small Outline Integrated Circuit 1.27 mm Pitch; Code_JEDEC: MS-012-AA; Code_IPC: SOIC127P600-8; ComponentLink1Description: Manufacturer Link; ComponentLink1URL: http://www.national.com/; ComponentLink2Description: Datasheet; ComponentLink2URL: http://www.national.com/ds.cgi/LM/LM386.pdf; ComponentLink3Description: URL Link1; ComponentLink3URL: http://www.national.com/pf/LM/LM386.html
X4 = XTAL: Crystal Oscillator; Published: 8-Jun-2000; Revision: July-2002: Re-released for DXP Platform.; Publisher: Altium Limited

## Sheet POWER.SchDoc
size A3
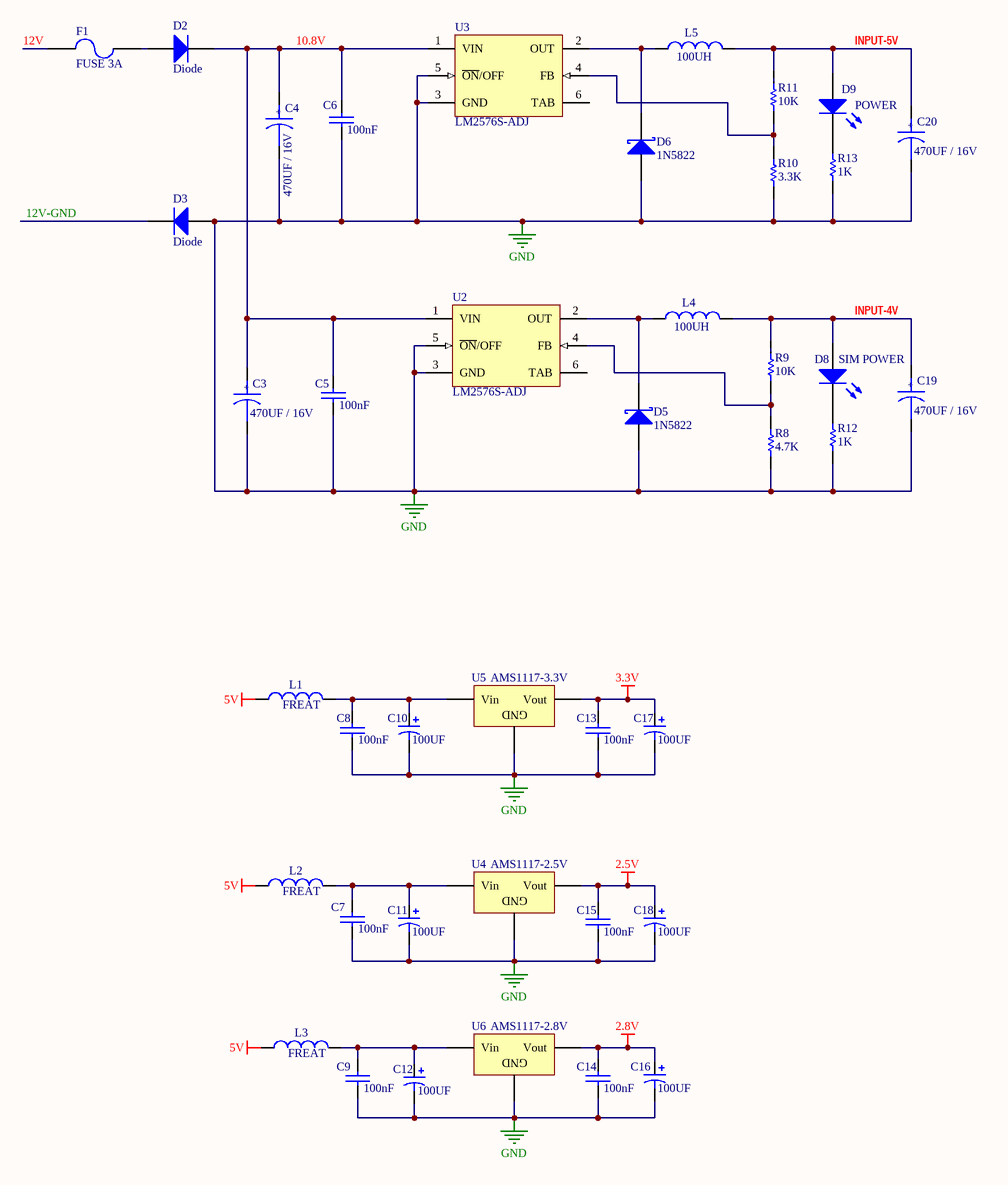
[diagram p4: POWER.SchDoc]

### Parts
C3  470UF / 16V  [470UF-SMD]
C4  470UF / 16V  [470UF-SMD]
C5  100nF  [0805C]
C6  100nF  [0805C]
C7  100nF  [0805C]
C8  100nF  [0805C]
C9  100nF  [0805C]
C10  value 100UF  [100UF-SMD]  (hidden comment: 100uF / 16V SMD)
C11  value 100UF  [100uf-smd]  (hidden comment: 100uF / 16V SMD)
C12  value 100UF  [100uf-smd]  (hidden comment: 100uF / 16V SMD)
C13  100nF  [0805C]
C14  100nF  [0805C]
C15  100nF  [0805C]
C16  value 100UF  [100uf-smd]  (hidden comment: 100uF / 16V SMD)
C17  value 100UF  [100uf-smd]  (hidden comment: 100uF / 16V SMD)
C18  value 100UF  [100uf-smd]  (hidden comment: 100uF / 16V SMD)
C19  470UF / 16V  [470UF-SMD]
C20  470UF / 16V  [470UF-SMD]
D2  Diode  [Diode]
D3  Diode  [Diode]
D5  1N5822  [SMB]
D6  1N5822  [SMB]
D8  Publisher: SIM POWER  [0805D]  (hidden comment: LED)
D9  LED  [0805D]  (value not drawn)
F1  FUSE 3A  [FUSE]
L1  FREAT  [1206]
L2  FREAT  [1206]
L3  FREAT  [1206]
L4  100UH  [100UH 1]
L5  100UH  [100UH 1]
R8  4.7K  [0805]
R9  10K  [0805]
R10  3.3K  [0805]
R11  10K  [0805]
R12  1K  [0805]
R13  1K  [0805]
U2  LM2576S-ADJ  [TS5B_N]
U3  LM2576S-ADJ  [TS5B_N]
U4  AMS1117-2.5V  [sot223]
U5  AMS1117-3.3V  [sot223]
U6  AMS1117-2.8V  [sot223]

### Nets
2.5V: C15.1 C18.1 U4.2(Vout)
2.8V: C14.1 C16.1 U6.2(Vout)
3.3V: C13.1 C17.1 U5.2(Vout)
5V: L1.1 L2.1 L3.1
GND: C3.2 C4.2 C5.2 C6.2 C7.2 C8.2 C9.2 C10.2 C11.2 C12.2 C13.2 C14.2 C15.2 C16.2 C17.2 C18.2 C19.2 C20.2 D3.1(A) D5.1(A) D6.1(A) R8.1 R10.1 R12.2 R13.2 U2.3(GND) U2.5(~{ON}/OFF) U3.3(GND) U3.5(~{ON}/OFF) U4.1(GND) U5.1(GND) U6.1(GND)
10.8V: C3.1 C4.1 C5.1 C6.1 D2.2(K) U2.1(VIN) U3.1(VIN)
12V: F1.1
12V-GND: D3.2(K)
INPUT-4V: C19.1 D8.1(A) L4.2 R9.2
INPUT-5V: C20.1 D9.1(A) L5.2 R11.2
NetC7_1: C7.1 C11.1 L2.2 U4.3(Vin)
NetC8_1: C8.1 C10.1 L1.2 U5.3(Vin)
NetC9_1: C9.1 C12.1 L3.2 U6.3(Vin)
NetD2_1: D2.1(A) F1.2
NetD5_2: D5.2(K) L4.1 U2.2(OUT)
NetD6_2: D6.2(K) L5.1 U3.2(OUT)
NetD8_2: D8.2(K) R12.1
NetD9_2: D9.2(K) R13.1
NetR8_2: R8.2 R9.1 U2.4(FB)
NetR10_2: R10.2 R11.1 U3.4(FB)

Not connected (* = marked no-connect by the designer): U2 6(TAB); U3 6(TAB)

### Notes on the sheet
- (in symbol CAPACITOR POL) +

### Library data of the parts
C3 C4 C19 C20 = CAPACITOR POL: Capacitor; Section Code: 12117032
C5-C9 C13-C15 = CAP
C10-C12 C16-C18 = Cap Pol1: Polarized Capacitor (Radial); Published: 8-Jun-2000; LatestRevisionDate: 17-Jul-2002; LatestRevisionNote: Re-released for DXP Platform.; PackageReference: RB7.6-15; Publisher: Altium Limited
D2 D3 = Diode: Default Diode; Published: 8-Jun-2000; LatestRevisionDate: 17-Jul-2002; LatestRevisionNote: Re-released for DXP Platform.; PackageDocument: Sep-1996; PackageReference: SMC; Publisher: Altium Limited; Code_JEDEC: DO-214-AB
D5 D6 = D Schottky: Schottky Diode; Published: 8-Jun-2000; LatestRevisionDate: 17-Jul-2002; LatestRevisionNote: Re-released for DXP Platform.; PackageReference: SMB; Publisher: Altium Limited; Code_JEDEC: DO-214-AA
D8 D9 = LED3: Typical BLUE SiC LED; Published: 8-Jun-2000; LatestRevisionDate: 17-Dec-2003; LatestRevisionNote: PCB Footprint replaced.; DatasheetVersion: 16-Apr-2002; PackageVersion: 16-Apr-2002; PackageReference: 3.5X2.8X1.9; PackageDescription: SM LED; 2 C-Bend Leads; Body 3.5 x 2.8 x 1.9 mm, inc leads (LxWxH typ)
  D9: POWER: POWER
F1 = FUSE2: Fuse
L1-L5 = Inductor: Code_IEC: 1005; Value: 250mA; Published: 8-Jun-2000; LatestRevisionDate: 29-May-2009; LatestRevisionNote: IPC-7351 Footprint Added.; PackageReference: 0402-A; Publisher: Altium Limited; PackageDescription: Chip Inductor; Code_JEITA: 0402
R8-R11 = Res Semi: Semiconductor Resistor; Published: 8-Jun-2000; LatestRevisionDate: 17-Jul-2002; LatestRevisionNote: Re-released for DXP Platform.; PackageReference: AXIAL-0.5; Publisher: Altium Limited
  R8: Value: 4.7K
  R9 R11: Value: 10K
  R10: Value: 3.3K
R12 R13 = Res1: Resistor; Published: 8-Jun-2000; Revision: July-2002: Re-released for DXP Platform.; Publisher: Altium Limited; Value: 1K
U2 U3 = LM2576S-ADJ: SIMPLE SWITCHER® 3A Step-Down Voltage Regulator, 5-pin TO-263; Manufacturer: National Semiconductor; PackageTopMarking: NSUZXYTTE#*LM2576S*-ADJ P+; PowerWise: N; Published: 4-Dec-2008; DatasheetVersion: Aug-2004; PackageVersion: revD, Apr-2005; PackageReference: TS5B; Publisher: Altium Limited; PackageDescription: TO-263, Molded, .400 x .390 x .180in, 5 Lead, .067in Pitch, Surface Mount; PartNumber: LM2576S-ADJ; RoHS: N; PinCount: 5; CompType: Switcher; Code_JEDEC: MO-169-AB; ComponentLink1Description: LM2576 Datasheet; ComponentLink1URL: http://www.national.com/ds/LM/LM2576.pdf; ComponentLink2Description: LM2576 Web Page; ComponentLink2URL: http://www.national.com/pf/LM/LM2576.html; ComponentLink3Description: TS5B Package Page; ComponentLink3URL: http://www.national.com/packaging/folders/ts5b.html
U4-U6 = Volt Reg: Voltage Regulator; Published: 24-Mar-1999; LatestRevisionDate: 17-Jul-2002; LatestRevisionNote: Re-released for DXP Platform.; PackageReference: D2PAK; Publisher: Altium Limited; Code_JEDEC: SMD-220

## Sheet PHONE.SchDoc
size A3
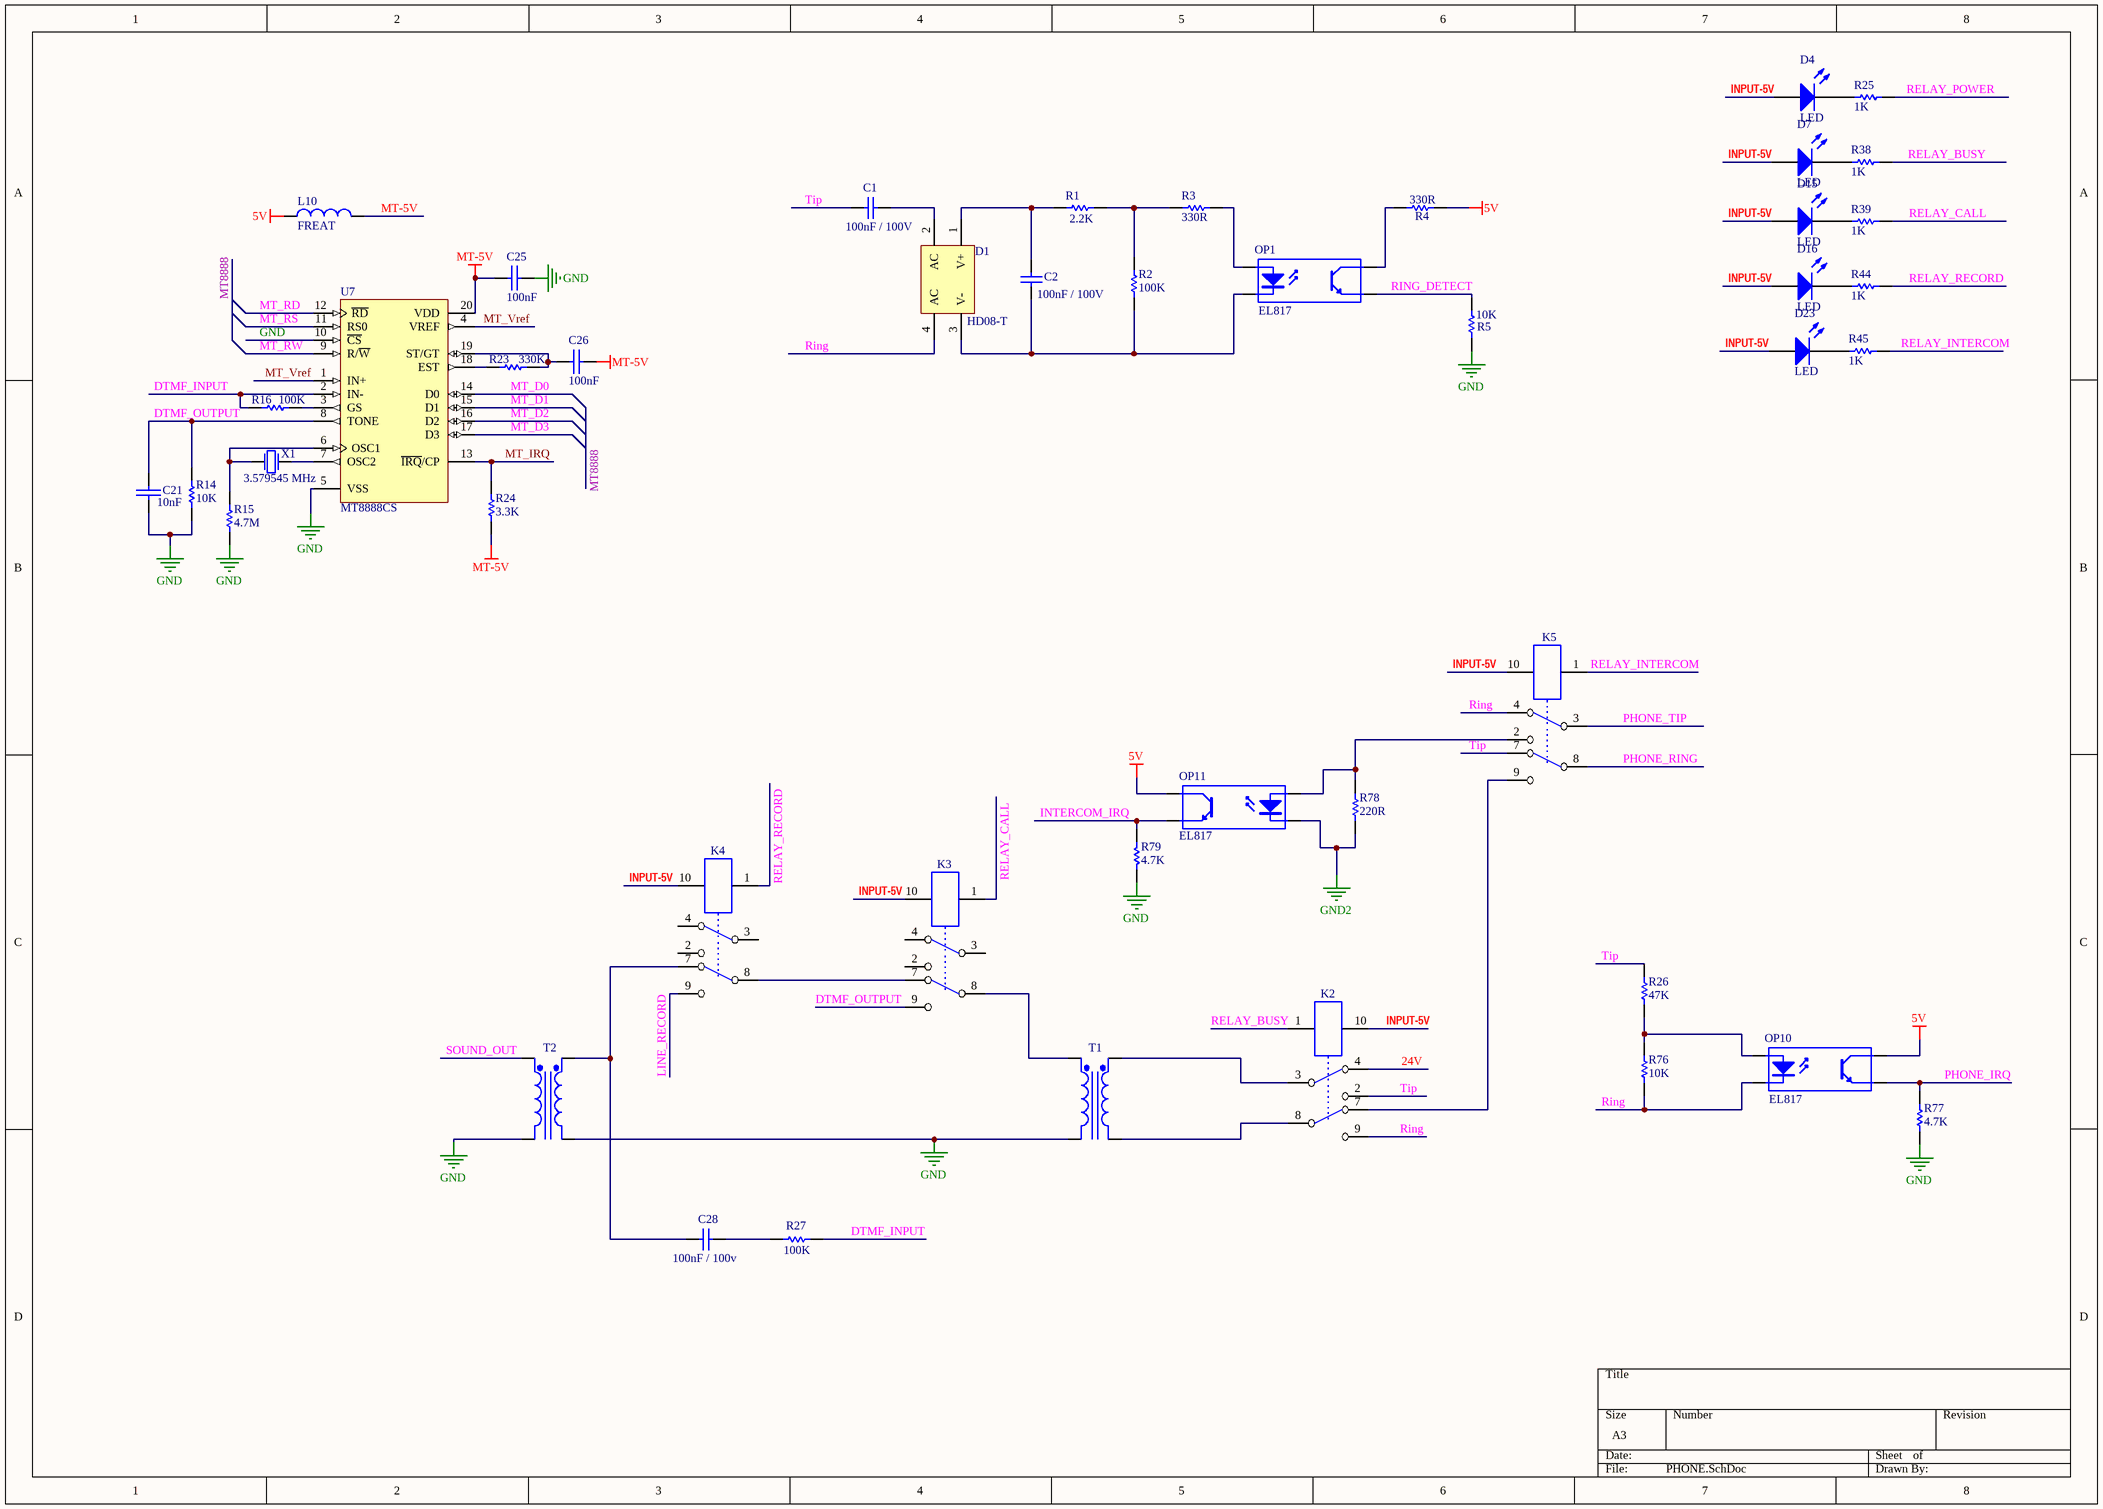
[diagram p5: PHONE.SchDoc]

### Parts
C1  100nF / 100V  [RAD-0.3]
C2  100nF / 100V  [RAD-0.3]
C21  10nF  [0805c]
C25  100nF  [0805c]
C26  100nF  [0805c]
C28  value 100nF / 100v  [1206]  (hidden comment: 100uF / 100V)
D1  HD08-T  [HD08-T]
D4  LED  [0805d]
D7  LED  [0805d]
D15  LED  [0805d]
D16  LED  [0805d]
D23  LED  [0805d]
K2  RELAY 5V  [RELAY G6H]  (value not drawn)
K3  RELAY 5V  [RELAY G6H]  (value not drawn)
K4  RELAY 5V  [RELAY G6H]  (value not drawn)
K5  RELAY 5V  [RELAY G6H]  (value not drawn)
L10  FREAT  [1206]
OP1  EL817  [EL817]
OP10  EL817  [EL817]
OP11  EL817  [EL817]
R1  2.2K  [0805]
R2  100K  [0805]
R3  330R  [0805]
R4  330R  [0805]
R5  10K  [0805]
R14  10K  [0805]
R15  4.7M  [0805]
R16  100K  [0805]
R23  value 330K  [0805]  (hidden comment: 374K)
R24  3.3K  [0805]
R25  1K  [0805]
R26  47K  [0805]
R27  100K  [0805]
R38  1K  [0805]
R39  1K  [0805]
R44  1K  [0805]
R45  1K  [0805]
R76  10K  [0805]
R77  4.7K  [0805]
R78  value 220R  [0805]  (hidden comment: 220)
R79  4.7K  [0805]
T1  TRANCE 300 :300  [trance]  (value not drawn)
T2  TRANCE 300 :300  [trance]  (value not drawn)
U7  MT8888CS  [SOIC20_N]
X1  3.579545 MHz  [crystal]

### Nets
5V: L10.2 OP10.4(C) OP11.4(C) R4.2
24V: K2.4(NC1)
GND: C21.2 C25.1 R5.1 R14.1 R15.1 R77.2 R79.2 T1.2(Pri-) T2.2(Pri-) T2.4(Sec-) U7.5(VSS) U7.10(~{CS})
GND2: OP11.2(K) R78.2
MT-5V: C25.2 C26.1 L10.1 R24.1 U7.20(VDD)
DTMF_INPUT: R16.2 R27.1 U7.2(IN-)
DTMF_OUTPUT: C21.1 K3.9(NO2) R14.2 U7.8(TONE)
INPUT-5V: D4.1(A) D7.1(A) D15.1(A) D16.1(A) D23.1(A) K2.10(-) K3.10(-) K4.10(-) K5.10(-)
INTERCOM_IRQ: OP11.3(E) R79.1
LINE_RECORD: K4.9(NO2)
MT_D0: U7.14(D0)
MT_D1: U7.15(D1)
MT_D2: U7.16(D2)
MT_D3: U7.17(D3)
MT_IRQ: R24.2 U7.13(~{IRQ}/CP)
MT_RD: U7.12(~{RD})
MT_RS: U7.11(RS0)
MT_RW: U7.9(R/~{W})
MT_Vref: U7.1(IN+) U7.4(VREF)
PHONE_IRQ: OP10.3(E) R77.1
PHONE_RING: K5.8(C2)
PHONE_TIP: K5.3(C1)
RELAY_BUSY: K2.1(+) R38.2
RELAY_CALL: K3.1(+) R39.2
RELAY_INTERCOM: K5.1(+) R45.2
RELAY_POWER: R25.2
RELAY_RECORD: K4.1(+) R44.2
Ring: D1.4(AC) K2.9(NO2) K5.4(NC1) OP10.2(K) R76.2
RING_DETECT: OP1.3(E) R5.2
SOUND_OUT: T2.1(Pri+)
Tip: C1.2 K2.2(NO1) K5.7(NC2) R26.2
NetC1_1: C1.1 D1.2(AC)
NetC2_1: C2.1 D1.3(V-) OP1.2(K) R2.2
NetC2_2: C2.2 D1.1(V+) R1.1
NetC26_2: C26.2 R23.1 U7.19(ST/GT)
NetC28_1: C28.1 K4.7(NC2) T2.3(Sec+)
NetC28_2: C28.2 R27.2
NetD4_2: D4.2(K) R25.1
NetD7_2: D7.2(K) R38.1
NetD15_2: D15.2(K) R39.1
NetD16_2: D16.2(K) R44.1
NetD23_2: D23.2(K) R45.1
NetK2_3: K2.3(C1) T1.3(Sec+)
NetK2_7: K2.7(NC2) K5.9(NO2)
NetK2_8: K2.8(C2) T1.4(Sec-)
NetK3_7: K3.7(NC2) K4.8(C2)
NetK3_8: K3.8(C2) T1.1(Pri+)
NetK5_2: K5.2(NO1) OP11.1(A) R78.1
NetOP1_1: OP1.1(A) R3.2
NetOP1_4: OP1.4(C) R4.1
NetOP10_1: OP10.1(A) R26.1 R76.1
NetR1_2: R1.2 R2.1 R3.1
NetR15_2: R15.2 U7.6(OSC1) X1.1(P1)
NetR16_1: R16.1 U7.3(GS)
NetR23_2: R23.2 U7.18(EST)
NetU7_7: U7.7(OSC2) X1.2(P2)

Not connected (* = marked no-connect by the designer): K3 2(NO1) 3(C1) 4(NC1); K4 2(NO1) 3(C1) 4(NC1)

### Buses and harness runs
bus MT8888

### Library data of the parts
C1 C2 C28 = Cap: Capacitor; Published: 8-Jun-2000; LatestRevisionDate: 17-Jul-2002; LatestRevisionNote: Re-released for DXP Platform.; PackageReference: RAD-0.3; Publisher: Altium Limited
C21 C25 C26 = CAP
D1 = Bridge2: Diode Bridge; Published: 24-Mar-1999; LatestRevisionDate: 17-Jul-2002; LatestRevisionNote: Re-released for DXP Platform.; PackageReference: D-46_6A; Publisher: Altium Limited; PackageDescription: Bridge Rectifier; 4 Terminals; Body 16.8 x 16.8 mm (typ); Pitch 10.67 mm
D4 D7 D15 D16 D23 = LED1: Typical RED GaAs LED; Published: 8-Jun-2000; LatestRevisionDate: 08-Jul-2005; LatestRevisionNote: Mech Layer 1 removed.; PackageReference: LED-1; Publisher: Altium Limited
K2-K5 = RELAY DPDT-G6HU
L10 = Inductor: Code_IEC: 1005; Value: 250mA; Published: 8-Jun-2000; LatestRevisionDate: 29-May-2009; LatestRevisionNote: IPC-7351 Footprint Added.; PackageReference: 0402-A; Publisher: Altium Limited; PackageDescription: Chip Inductor; Code_JEITA: 0402
OP1 OP10 OP11 = Optoisolator1: 4-Pin Phototransistor Optocoupler; Published: 24-Mar-1999; LatestRevisionDate: 04-Mar-2005; LatestRevisionNote: Sch pins 3 & 4 Swapped.; DatasheetVersion: Nov-2003; PackageReference: DIP-4; Publisher: Altium Limited
R1-R5 R14-R16 R23 R24 R26 R27 R76-R79 = Res Semi: Semiconductor Resistor; Published: 8-Jun-2000; LatestRevisionDate: 17-Jul-2002; LatestRevisionNote: Re-released for DXP Platform.; PackageReference: AXIAL-0.5; Publisher: Altium Limited
  R2: Value: 100K
  R3: Value: 330R
  R14 R76: PackageDescription: Axial Device, Thru-Hole; 2 Leads; 0.5 in Pin Spacing; Value: 10K
  R15: PackageDescription: Axial Device, Thru-Hole; 2 Leads; 0.5 in Pin Spacing; Value: 4.7M
  R16 R27: PackageDescription: Axial Device, Thru-Hole; 2 Leads; 0.5 in Pin Spacing; Value: 100K
  R23 R78: PackageDescription: Axial Device, Thru-Hole; 2 Leads; 0.5 in Pin Spacing
  R24: PackageDescription: Axial Device, Thru-Hole; 2 Leads; 0.5 in Pin Spacing; Value: 3.3K
  R26: Value: 47K
  R77 R79: PackageDescription: Axial Device, Thru-Hole; 2 Leads; 0.5 in Pin Spacing; Value: 4.7K
R25 R38 R39 R44 R45 = Res1: Resistor; Published: 8-Jun-2000; LatestRevisionDate: 17-Jul-2002; LatestRevisionNote: Re-released for DXP Platform.; PackageReference: AXIAL-0.3; Publisher: Altium Limited
T1 T2 = Trans Ideal: Transformer (Ideal); Published: 8-Jun-2000; LatestRevisionDate: 17-Jul-2002; LatestRevisionNote: Re-released for DXP Platform.; PackageReference: TRF_4; Publisher: Altium Limited
U7 = MT8888CS: Integrated DTMF Transceiver with Intel Micro Interface; Published: 8-Jun-2000; LatestRevisionDate: 13-Apr-2006; LatestRevisionNote: IPC-7351 Footprint Added.; DatasheetVersion: Issue 6 March 1997; PackageVersion: 1997; PackageReference: SOIC20; Publisher: Altium Limited; PackageDescription: 20-Pin Small Outline Integrated Circuit 1.27 mm Pitch; Code_JEDEC: MS-013-AC; Code_IPC: SOIC127P1030-20; ComponentLink1Description: Manufacturer Link; ComponentLink1URL: http://products.zarlink.com; ComponentLink2Description: Datasheet; ComponentLink2URL: http://assets.zarlink.com/DS/zarlink_MT8888C_JUN_05.pdf
X1 = 16.000MHZ: as X2 on sheet SmartHome V3; Part Field 2: HC49; Part Field 4: 1ppm

## Sheet PLC.SchDoc
size A3
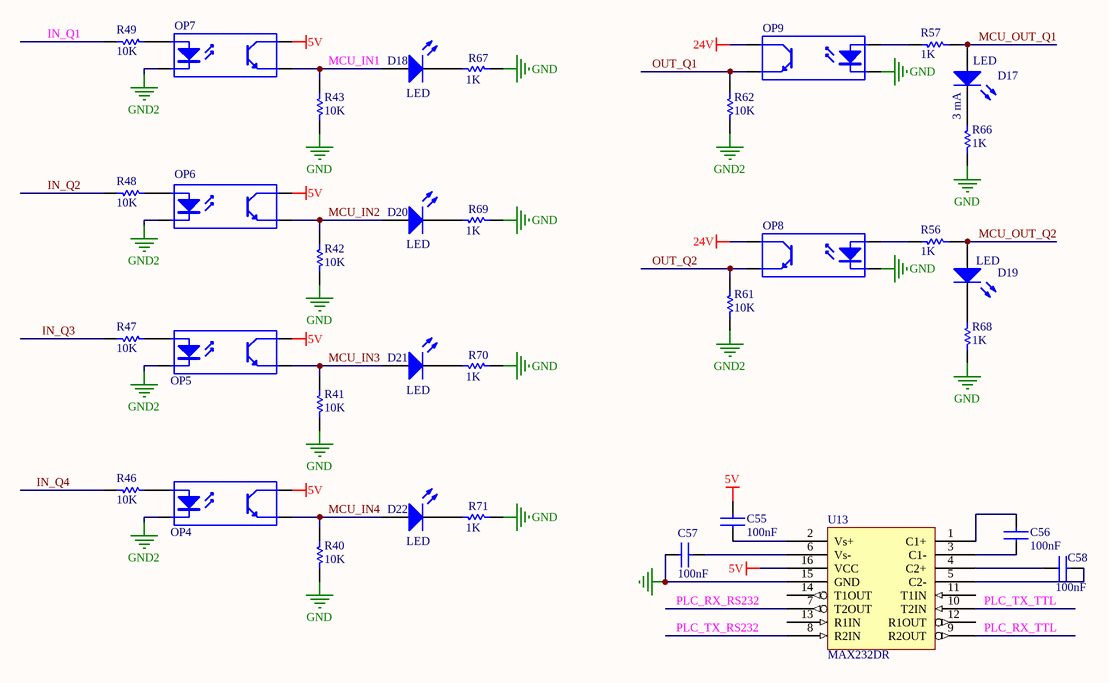
[diagram p6: PLC.SchDoc]

### Parts
C55  100nF  [0805C]
C56  100nF  [0805c]
C57  100nF  [0805c]
C58  100nF  [0805c]
D17  LED  Publisher: 3 mA  [0805D]
D18  LED  [0805D]
D19  LED  [0805D]
D20  LED  [0805D]
D21  LED  [0805D]
D22  LED  [0805D]
OP4  EL817  [EL817]  (value not drawn)
OP5  EL817  [EL817]  (value not drawn)
OP6  EL817  [EL817]  (value not drawn)
OP7  EL817  [EL817]  (value not drawn)
OP8  EL817  [EL817]  (value not drawn)
OP9  EL817  [EL817]  (value not drawn)
R40  10K  [0805]
R41  10K  [0805]
R42  10K  [0805]
R43  10K  [0805]
R46  10K  [0805]
R47  10K  [0805]
R48  10K  [0805]
R49  10K  [0805]
R56  1K  [0805]
R57  1K  [0805]
R61  10K  [0805]
R62  10K  [0805]
R66  1K  [0805]
R67  1K  [0805]
R68  1K  [0805]
R69  1K  [0805]
R70  1K  [0805]
R71  1K  [0805]
U13  MAX232DR  [L16_N]

### Nets
5V: C55.2 OP4.4(C) OP5.4(C) OP6.4(C) OP7.4(C) U13.16(VCC)
24V: OP8.4(C) OP9.4(C)
GND: C57.1 OP8.2(K) OP9.2(K) R40.2 R41.2 R42.2 R43.2 R66.2 R67.2 R68.2 R69.2 R70.2 R71.2 U13.15(GND)
GND2: OP4.2(K) OP5.2(K) OP6.2(K) OP7.2(K) R61.1 R62.1
IN_Q1: R49.1
IN_Q2: R48.1
IN_Q3: R47.1
IN_Q4: R46.1
MCU_IN1: D18.1(A) OP7.3(E) R43.1
MCU_IN2: D20.1(A) OP6.3(E) R42.1
MCU_IN3: D21.1(A) OP5.3(E) R41.1
MCU_IN4: D22.1(A) OP4.3(E) R40.1
MCU_OUT_Q1: D17.1(A) R57.2
MCU_OUT_Q2: D19.1(A) R56.2
OUT_Q1: OP9.3(E) R62.2
OUT_Q2: OP8.3(E) R61.2
PLC_RX_RS232: U13.7(T2OUT)
PLC_RX_TTL: U13.9(R2OUT)
PLC_TX_RS232: U13.8(R2IN)
PLC_TX_TTL: U13.10(T2IN)
NetC55_1: C55.1 U13.2(Vs+)
NetC56_1: C56.1 U13.3(C1-)
NetC56_2: C56.2 U13.1(C1+)
NetC57_2: C57.2 U13.6(Vs-)
NetC58_1: C58.1 U13.4(C2+)
NetC58_2: C58.2 U13.5(C2-)
NetD17_2: D17.2(K) R66.1
NetD18_2: D18.2(K) R67.1
NetD19_2: D19.2(K) R68.1
NetD20_2: D20.2(K) R69.1
NetD21_2: D21.2(K) R70.1
NetD22_2: D22.2(K) R71.1
NetOP4_1: OP4.1(A) R46.2
NetOP5_1: OP5.1(A) R47.2
NetOP6_1: OP6.1(A) R48.2
NetOP7_1: OP7.1(A) R49.2
NetOP8_1: OP8.1(A) R56.1
NetOP9_1: OP9.1(A) R57.1

Not connected (* = marked no-connect by the designer): U13 11(T1IN) 12(R1OUT) 13(R1IN) 14(T1OUT)

### Library data of the parts
C55-C58 = CAP NP: Part Field 1: CS; Section Code: 12103465; Part Field 2: 0603; Part Field 3: 20V
D17-D22 = LED3: Typical BLUE SiC LED; Published: 8-Jun-2000; LatestRevisionDate: 17-Dec-2003; LatestRevisionNote: PCB Footprint replaced.; DatasheetVersion: 16-Apr-2002; PackageVersion: 16-Apr-2002; PackageReference: 3.5X2.8X1.9; PackageDescription: SM LED; 2 C-Bend Leads; Body 3.5 x 2.8 x 1.9 mm, inc leads (LxWxH typ)
  D18-D22: Publisher: Altium Limited
OP4-OP9 = Optoisolator1: 4-Pin Phototransistor Optocoupler
  OP4-OP7 OP9: Published: 24-Mar-1999; LatestRevisionDate: 04-Mar-2005; LatestRevisionNote: Sch pins 3 & 4 Swapped.; DatasheetVersion: Nov-2003; PackageReference: DIP-4; Publisher: Altium Limited
R40-R43 R46-R49 R56 R57 R61 R62 R66-R71 = Res Semi: Semiconductor Resistor; Published: 8-Jun-2000; LatestRevisionDate: 17-Jul-2002; LatestRevisionNote: Re-released for DXP Platform.; PackageReference: AXIAL-0.5; Publisher: Altium Limited; PackageDescription: Axial Device, Thru-Hole; 2 Leads; 0.5 in Pin Spacing
  R40-R43 R46-R49 R61 R62: Value: 10K
  R56 R57 R66-R71: Value: 1K
U13 = MAX232: as U8 on sheet SmartHome V3; Part Field 2: SOL-16

## Nets that join several sheets
2.5V: VS1003 (6 pins), POWER (C15.1 C18.1 U4.2)
2.8V: VS1003 (6 pins), POWER (C14.1 C16.1 U6.2)
3.3V: SmartHome V3 (L6.2 S1.4), VS1003 (7 pins), POWER (C13.1 C17.1 U5.2)
4V: SmartHome V3 (K1.2), SIM900 (6 pins)
5V: SmartHome V3 (5 pins), SIM900 (P5.1), VS1003 (L7.2), POWER (L1.1 L2.1 L3.1), PHONE (L10.2 OP10.4 OP11.4 R4.2), PLC (6 pins)
24V: SmartHome V3 (P2.3), PHONE (K2.4), PLC (OP8.4 OP9.4)
GND: SmartHome V3 (55 pins), SIM900 (25 pins), VS1003 (32 pins), POWER (32 pins), PHONE (12 pins), PLC (14 pins)
GND2: SmartHome V3 (P2.4), PHONE (OP11.2 R78.2), PLC (6 pins)
12V: SmartHome V3 (P2.1), POWER (F1.1)
12V-GND: SmartHome V3 (P2.2), POWER (D3.2)
IN_Q1: SmartHome V3 (P1.7), PLC (R49.1)
IN_Q2: SmartHome V3 (P1.8), PLC (R48.1)
IN_Q3: SmartHome V3 (P1.9), PLC (R47.1)
IN_Q4: SmartHome V3 (P1.10), PLC (R46.1)
INPUT-4V: SmartHome V3 (K1.3), POWER (C19.1 D8.1 L4.2 R9.2)
INPUT-5V: SmartHome V3 (K1.8 K1.10 L8.2 U9.9), POWER (C20.1 D9.1 L5.2 R11.2), PHONE (9 pins)
INTERCOM_IRQ: SmartHome V3 (U1.33), PHONE (OP11.3 R79.1)
LINE_RECORD: VS1003 (C36.1), PHONE (K4.9)
MCU-SIM-RESET: SmartHome V3 (U1.57), SIM900 (U14.7)
MCU_IN1: SmartHome V3 (U1.37), PLC (D18.1 OP7.3 R43.1)
MCU_IN2: SmartHome V3 (U1.38), PLC (D20.1 OP6.3 R42.1)
MCU_IN3: SmartHome V3 (U1.39), PLC (D21.1 OP5.3 R41.1)
MCU_IN4: SmartHome V3 (U1.40), PLC (D22.1 OP4.3 R40.1)
MCU_OUT_Q1: SmartHome V3 (U1.35), PLC (D17.1 R57.2)
MCU_OUT_Q2: SmartHome V3 (U1.36), PLC (D19.1 R56.2)
MISO: SmartHome V3 (S1.7 U1.22), VS1003 (U10.30)
MOSI: SmartHome V3 (S1.2 U1.23), VS1003 (U10.29)
MT_D0: SmartHome V3 (U1.11), PHONE (U7.14)
MT_D1: SmartHome V3 (U1.10), PHONE (U7.15)
MT_D2: SmartHome V3 (U1.9), PHONE (U7.16)
MT_D3: SmartHome V3 (U1.8), PHONE (U7.17)
MT_IRQ: SmartHome V3 (U1.14), PHONE (R24.2 U7.13)
MT_RD: SmartHome V3 (U1.15), PHONE (U7.12)
MT_RS: SmartHome V3 (U1.24), PHONE (U7.11)
MT_RW: SmartHome V3 (U1.25), PHONE (U7.9)
OUT_Q1: SmartHome V3 (P1.5), PLC (OP9.3 R62.2)
OUT_Q2: SmartHome V3 (P1.6), PLC (OP8.3 R61.2)
PHONE_IRQ: SmartHome V3 (U1.34), PHONE (OP10.3 R77.1)
PHONE_RING: SmartHome V3 (P2.9), PHONE (K5.8)
PHONE_TIP: SmartHome V3 (P2.10), PHONE (K5.3)
PLC_RX_RS232: SmartHome V3 (P2.6), PLC (U13.7)
PLC_RX_TTL: SmartHome V3 (U1.43), PLC (U13.9)
PLC_TX_RS232: SmartHome V3 (P2.7), PLC (U13.8)
PLC_TX_TTL: SmartHome V3 (U1.42), PLC (U13.10)
RELAY_BUSY: SmartHome V3 (U9.15), PHONE (K2.1 R38.2)
RELAY_CALL: SmartHome V3 (U9.14), PHONE (K3.1 R39.2)
RELAY_INTERCOM: SmartHome V3 (U9.12), PHONE (K5.1 R45.2)
RELAY_POWER: SmartHome V3 (K1.1 U9.16), PHONE (R25.2)
RELAY_RECORD: SmartHome V3 (U9.13), PHONE (K4.1 R44.2)
Ring: SmartHome V3 (P2.11), PHONE (5 pins)
RING_DETECT: SmartHome V3 (U1.27), PHONE (OP1.3 R5.2)
SCK: SmartHome V3 (S1.5 U1.21), VS1003 (U10.28)
SIM-POWER: SmartHome V3 (U1.26), SIM900 (M1.1)
SIM-RXD: SmartHome V3 (U1.16), SIM900 (M1.10)
SIM-TXD: SmartHome V3 (U1.17), SIM900 (M1.9)
SOUND_OUT: VS1003 (C53.2 P7.1), PHONE (T2.1)
Tip: SmartHome V3 (P2.12), PHONE (C1.2 K2.2 K5.7 R26.2)
VS1003_DREQ: SmartHome V3 (U1.59), VS1003 (U10.8)
VS1003_XCS: SmartHome V3 (U1.62), VS1003 (U10.23)
VS1003_XDCS: SmartHome V3 (U1.61), VS1003 (U10.13)
VS1003_XRESET: SmartHome V3 (U1.58), VS1003 (U10.3)